# Altium project ee453_pcb_N-B-S.PrjPcb
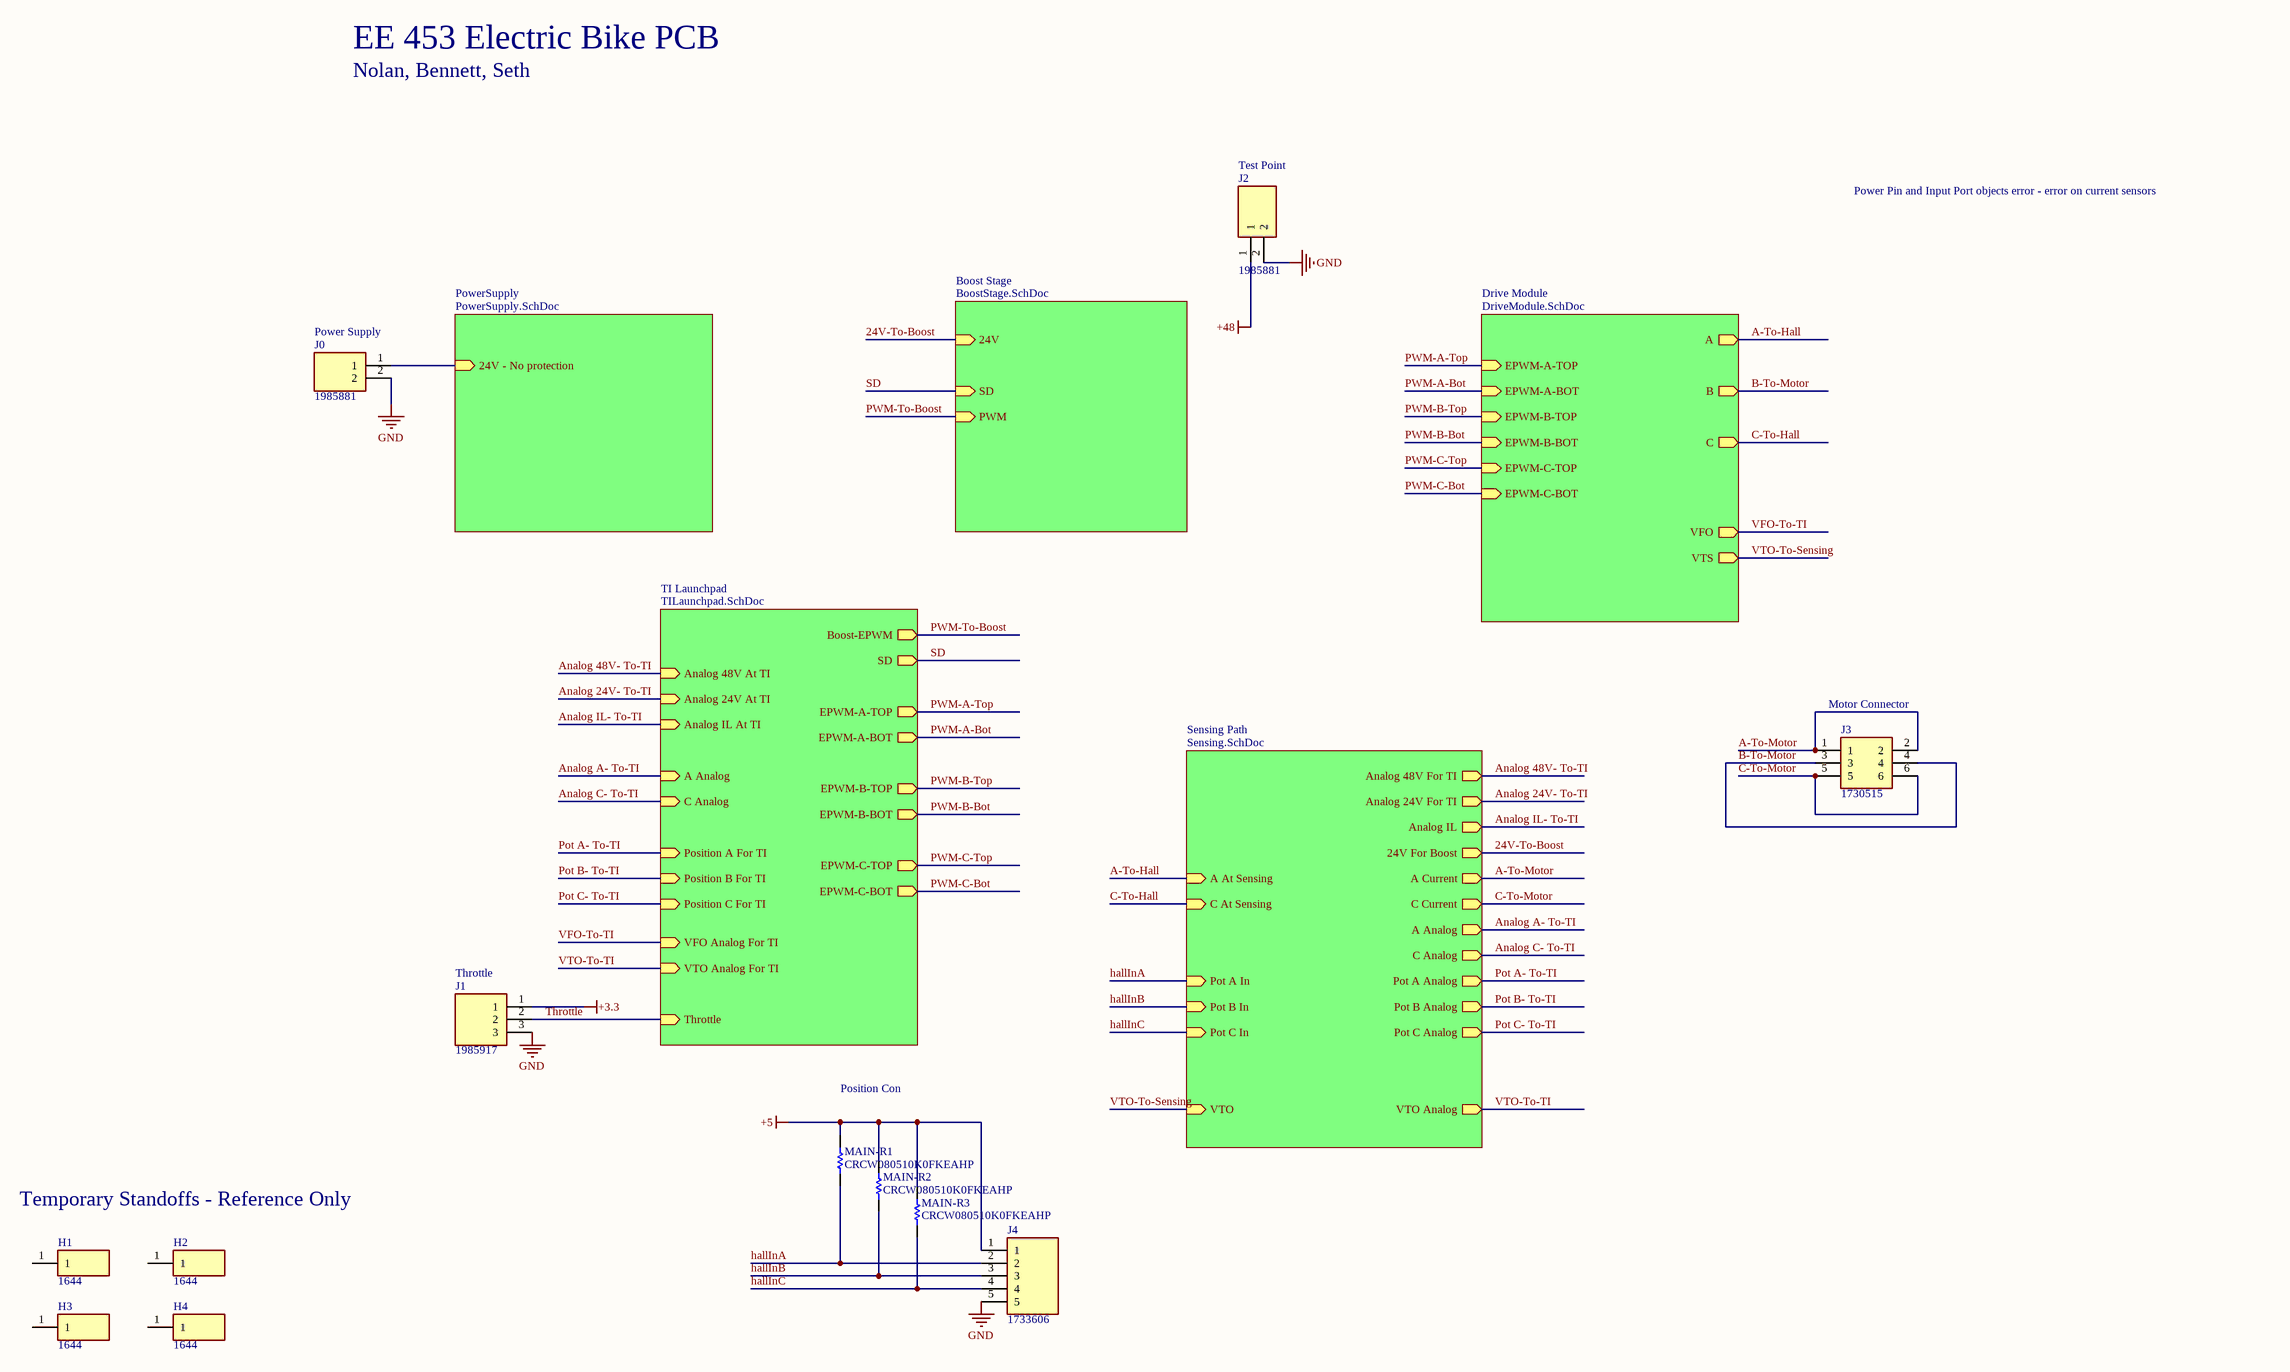
[diagram p0: ee453_pcb_N-B-S.SchDoc]
9 sheets, 101 parts. Net scope: hierarchical (ports join the sheet entries above them; power ports are global).
Board file: ee453_pcb_N-B-S.PcbDoc
Sheets:
  ee453_pcb_N-B-S.SchDoc
    PowerSupply = PowerSupply.SchDoc
    TI Launchpad = TILaunchpad.SchDoc
    Drive Module = DriveModule.SchDoc
    Boost Stage = BoostStage.SchDoc
    Sensing Path = Sensing.SchDoc
      Designator = VoltageSensing.SchDoc
      Designator = hallsensing.SchDoc
      Designator = positionsensing.SchDoc

## Sheet ee453_pcb_N-B-S.SchDoc: EE 453 Capstone
size C; ApprovedBy: Your Name; CheckedBy: Your Name; Author: Your Name; CompanyName: Dept. of Elec. and Comp. Engg.; DrawnBy: Your Name; Engineer: Your Nmae; Organization: UW-Seattle; Address1: 185 Stevens Way; Address2: Paul Allen Center; Address3: Seattle, WA; Address4: US-98195; DocumentNumber: 1; Revision: 1.0; SheetNumber: 1; SheetTotal: 1

### Parts
H1  1644  [1644]
H2  1644  [1644]
H3  1644  [1644]
H4  1644  [1644]
J0  1985881  [1985881]
J1  1985917  [1985917]
J2  1985881  [1985881]
J3  1730515  [1730515]
J4  1733606  [1733606]
MAIN-R1  CRCW080510K0FKEAHP  [RESC2013X60X40NL15T20]
MAIN-R2  CRCW080510K0FKEAHP  [RESC2013X60X40NL15T20]
MAIN-R3  CRCW080510K0FKEAHP  [RESC2013X60X40NL15T20]

### Sub-sheets
Boost Stage = BoostStage.SchDoc: 24V (in), SD (in), PWM (in)
Drive Module = DriveModule.SchDoc: EPWM-A-TOP (in), EPWM-A-BOT (in), EPWM-B-TOP (in), EPWM-B-BOT (in), EPWM-C-TOP (in), EPWM-C-BOT (in), A (out), B (out), C (out), VFO (out), VTS (out)
PowerSupply = PowerSupply.SchDoc: 24V - No protection (in)
Sensing Path = Sensing.SchDoc: A At Sensing (in), C At Sensing (in), Analog 24V For TI (out), Analog IL (out), A Current (out), C Current (out), Analog 48V For TI (out), Pot A Analog (out), Pot B Analog (out), Pot C Analog (out), Pot A In (in), Pot B In (in), Pot C In (in), A Analog (out), C Analog (out), 24V For Boost (out), VTO Analog (out), VTO (in)
TI Launchpad = TILaunchpad.SchDoc: Analog 24V At TI (in), Analog IL At TI (in), A Analog (in), C Analog (in), Boost-EPWM (out), EPWM-A-TOP (out), EPWM-A-BOT (out), EPWM-B-TOP (out), EPWM-B-BOT (out), EPWM-C-TOP (out), EPWM-C-BOT (out), Position A For TI (in), Position B For TI (in), Position C For TI (in), SD (out), Analog 48V At TI (in), VFO Analog For TI (in), VTO Analog For TI (in), Throttle (in)

### Nets
+3.3: J1.1
+5: J4.1 MAIN-R1.2 MAIN-R2.2 MAIN-R3.2
+48: J2.1
GND: J0.2 J1.3 J2.2 J4.5
24V-To-Boost: sheet Boost Stage/24V, sheet Sensing Path/24V For Boost
A-To-Hall: sheet Drive Module/A, sheet Sensing Path/A At Sensing
A-To-Motor: J3.1 J3.2 ; sheet Sensing Path/A Current
Analog 24V- To-TI: sheet TI Launchpad/Analog 24V At TI, sheet Sensing Path/Analog 24V For TI
Analog 48V- To-TI: sheet TI Launchpad/Analog 48V At TI, sheet Sensing Path/Analog 48V For TI
Analog A- To-TI: sheet TI Launchpad/A Analog, sheet Sensing Path/A Analog
Analog C- To-TI: sheet TI Launchpad/C Analog, sheet Sensing Path/C Analog
Analog IL- To-TI: sheet TI Launchpad/Analog IL At TI, sheet Sensing Path/Analog IL
B-To-Motor: J3.3 J3.4 ; sheet Drive Module/B
C-To-Hall: sheet Drive Module/C, sheet Sensing Path/C At Sensing
C-To-Motor: J3.5 J3.6 ; sheet Sensing Path/C Current
hallInA: J4.2 MAIN-R1.1 ; sheet Sensing Path/Pot A In
hallInB: J4.3 MAIN-R2.1 ; sheet Sensing Path/Pot B In
hallInC: J4.4 MAIN-R3.1 ; sheet Sensing Path/Pot C In
Pot A- To-TI: sheet TI Launchpad/Position A For TI, sheet Sensing Path/Pot A Analog
Pot B- To-TI: sheet TI Launchpad/Position B For TI, sheet Sensing Path/Pot B Analog
Pot C- To-TI: sheet TI Launchpad/Position C For TI, sheet Sensing Path/Pot C Analog
PWM-A-Bot: sheet TI Launchpad/EPWM-A-BOT, sheet Drive Module/EPWM-A-BOT
PWM-A-Top: sheet TI Launchpad/EPWM-A-TOP, sheet Drive Module/EPWM-A-TOP
PWM-B-Bot: sheet TI Launchpad/EPWM-B-BOT, sheet Drive Module/EPWM-B-BOT
PWM-B-Top: sheet TI Launchpad/EPWM-B-TOP, sheet Drive Module/EPWM-B-TOP
PWM-C-Bot: sheet TI Launchpad/EPWM-C-BOT, sheet Drive Module/EPWM-C-BOT
PWM-C-Top: sheet TI Launchpad/EPWM-C-TOP, sheet Drive Module/EPWM-C-TOP
PWM-To-Boost: sheet TI Launchpad/Boost-EPWM, sheet Boost Stage/PWM
SD: sheet TI Launchpad/SD, sheet Boost Stage/SD
Throttle: J1.2 ; sheet TI Launchpad/Throttle
VFO-To-TI: sheet TI Launchpad/VFO Analog For TI, sheet Drive Module/VFO
VTO-To-Sensing: sheet Drive Module/VTS, sheet Sensing Path/VTO
VTO-To-TI: sheet TI Launchpad/VTO Analog For TI, sheet Sensing Path/VTO Analog
NetJ0_1: J0.1 ; sheet PowerSupply/24V - No protection

Not connected (* = marked no-connect by the designer): H1 1; H2 1; H3 1; H4 1

### Notes on the sheet
- EE 453 Electric Bike PCB
- Nolan, Bennett, Seth
- Test Point
- Power Pin and Input Port objects error - error on current sensors
- (near J0) Power Supply
- (near J3) Motor Connector
- (near J1) Throttle
- Position Con
- Temporary Standoffs - Reference Only
- Title
- Size:
- Date:
- File:
- C
- Number:
- Time:
- Revision:
- Sheet
- of

### Library data of the parts
H1-H4 = 1644: Hardware; Manufacturer_Name: Keystone Electronics; Datasheet Link: https://www.mouser.com/datasheet/2/215/644-745864.pdf; Height: 25.4mm; Manufacturer_Part_Number: 1644; Mouser Part Number: 534-1644; Mouser Price/Stock: https://www.mouser.com/Search/Refine.aspx?Keyword=534-1644
J0 J2 = 1985881: Connector; Manufacturer_Name: Phoenix Contact; Datasheet Link: https://www.digikey.com/en/products/detail/phoenix-contact/1985881/2511015; Height: 13.9mm; Manufacturer_Part_Number: 1985881
J1 = 1985917: Connector; Manufacturer_Name: Phoenix Contact; Datasheet Link: https://media.digikey.com/pdf/Data%20Sheets/Phoenix%20Contact%20PDFs/Multi-Postion%20PCTerminal%20Blocks.pdf; Height: 13.95mm; Manufacturer_Part_Number: 1985917; Mouser Part Number: 651-1985917; Mouser Price/Stock: https://www.mouser.co.uk/ProductDetail/Phoenix-Contact/1985917/?qs=ibOxrZ%2Fd8eDdpJplVMXgvQ%3D%3D; Arrow Part Number: 1985917; Arrow Price/Stock: https://www.arrow.com/en/products/1985917/phoenix-contact
J3 = 1730515: Connector; Manufacturer_Name: Phoenix Contact; Datasheet Link: https://media.digikey.com/PDF/Data%20Sheets/Phoenix%20Contact%20PDFs/1730515.pdf; Height: 18mm; Manufacturer_Part_Number: 1730515; Mouser Part Number: 651-1730515; Mouser Price/Stock: https://www.mouser.com/Search/Refine.aspx?Keyword=651-1730515; Arrow Part Number: 1730515; Arrow Price/Stock: https://www.arrow.com/en/products/1730515/phoenix-contact
J4 = 1733606: Connector; Manufacturer_Name: Phoenix Contact; Datasheet Link: https://www.phoenixcontact.com/online/portal/us?uri=pxc-oc-itemdetail:pid=1733606&library=usen&tab=1; Height: 15.45mm; Manufacturer_Part_Number: 1733606; Mouser Part Number: 651-1733606; Mouser Price/Stock: https://www.mouser.co.uk/ProductDetail/Phoenix-Contact/1733606/?qs=coeDwHeOZKnxpzvXWWKBZQ%3D%3D; Arrow Part Number: 1733606; Arrow Price/Stock: https://www.arrow.com/en/products/1733606/phoenix-contact
MAIN-R1-MAIN-R3 = CMP-2001-04472-1: Manufacturer: Vishay Dale; Part Number: CRCW080510K0FKEAHP

## Sheet PowerSupply.SchDoc
size A
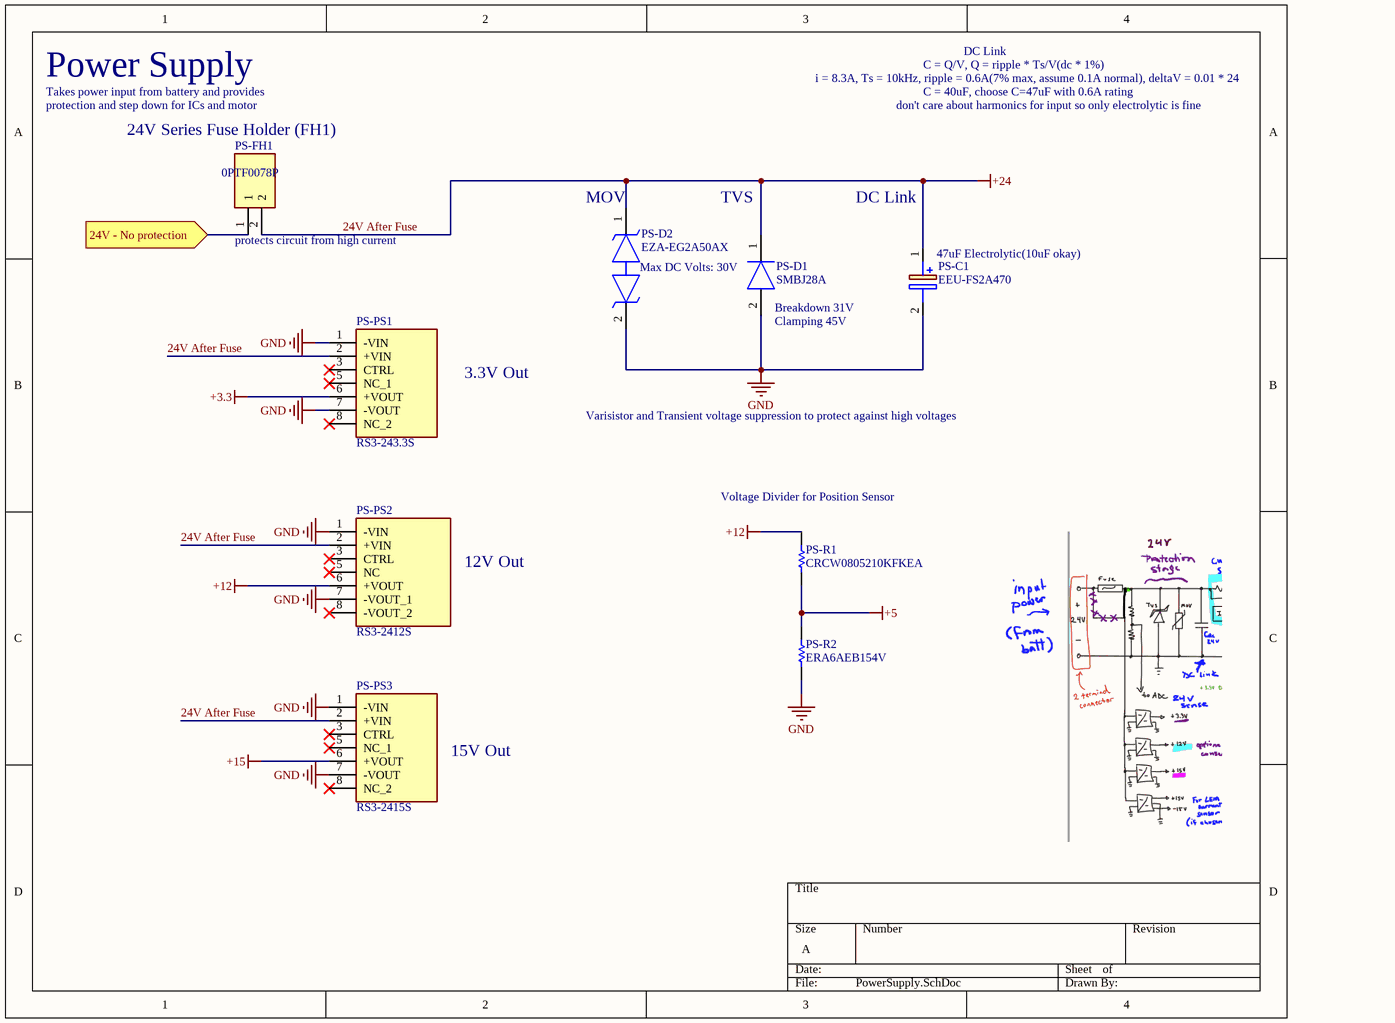
[diagram p1: PowerSupply.SchDoc]

### Parts
PS-C1  EEU-FS2A470  [CAPPRD350W65D800H1650]
PS-D1  SMBJ28A  [DIOM5436X261N]
PS-D2  EZA-EG2A50AX  [DIONC1005X43N]
PS-FH1  0PTF0078P  [0PTF0078P]
PS-PS1  RS3-243.3S  [RS32433S]
PS-PS2  RS3-2412S  [RS32415S]
PS-PS3  RS3-2415S  [RS32415S]
PS-R1  CRCW0805210KFKEA  [RESC2013X50X30LL20T20]
PS-R2  ERA6AEB154V  [RESC2013X60X40LL20T25]

### Ports
24V - No protection (in)

### Nets
24V After Fuse: PS-C1.1(+) PS-D1.1(K) PS-D2.1 PS-FH1.2 PS-PS1.2(+VIN) PS-PS2.2(+VIN) PS-PS3.2(+VIN)  [also labelled +24]
+3.3: PS-PS1.6(+VOUT)
+5: PS-R1.1 PS-R2.2
+12: PS-PS2.6(+VOUT) PS-R1.2
+15: PS-PS3.6(+VOUT)
GND: PS-C1.2(-) PS-D1.2(A) PS-D2.2 PS-PS1.1(-VIN) PS-PS1.7(-VOUT) PS-PS2.1(-VIN) PS-PS2.7(-VOUT_1) PS-PS3.1(-VIN) PS-PS3.7(-VOUT) PS-R2.1
NetJ0_1: PS-FH1.1 ; port 24V - No protection

Not connected (* = marked no-connect by the designer): PS-PS1 3(CTRL)* 5(NC_1)* 8(NC_2)*; PS-PS2 3(CTRL)* 5(NC)* 8(-VOUT_2)*; PS-PS3 3(CTRL)* 5(NC_1)* 8(NC_2)*

### Notes on the sheet
- Power Supply
- Takes power input from battery and provides
- i = 8.3A, Ts = 10kHz, ripple = 0.6A(7% max, assume 0.1A normal), deltaV = 0.01 * 24
- C = Q/V, Q = ripple * Ts/V(dc * 1%)
- C = 40uF, choose C=47uF with 0.6A rating
- DC Link
- protection and step down for ICs and motor
- 24V Series Fuse Holder (FH1)
- don't care about harmonics for input so only electrolytic is fine
- (near PS-D2) MOV
- TVS
- (near PS-FH1) protects circuit from high current
- Max DC Volts: 30V
- (near PS-C1) 47uF Electrolytic(10uF okay)
- (near PS-D1) Breakdown 31V
- (near PS-D1) Clamping 45V
- 3.3V Out
- Varisistor and Transient voltage suppression to protect against high voltages
- (near PS-R1) Voltage Divider for Position Sensor
- 12V Out
- 15V Out

### Library data of the parts
PS-C1 = EEU-FS2A470: Capacitor Polarised 47uF; Manufacturer_Name: Panasonic; Datasheet Link: https://componentsearchengine.com/Datasheets/1/EEU-FS2A470.pdf; Height: 16.5mm; Manufacturer_Part_Number: EEU-FS2A470; Mouser Part Number: 667-EEU-FS2A470; Mouser Price/Stock: https://www.mouser.co.uk/ProductDetail/Panasonic/EEU-FS2A470?qs=w%2Fv1CP2dgqrDlaRaE647gA%3D%3D; Arrow Part Number: EEU-FS2A470; Arrow Price/Stock: https://www.arrow.com/en/products/eeu-fs2a470/panasonic
PS-D1 = SMBJ28A: Diode; Manufacturer_Name: LITTELFUSE; Datasheet Link: https://componentsearchengine.com/Datasheets/2/SMBJ28A.pdf; Height: 2.61mm; Manufacturer_Part_Number: SMBJ28A; Mouser Part Number: 576-SMBJ28A; Mouser Price/Stock: https://www.mouser.co.uk/ProductDetail/Littelfuse/SMBJ28A?qs=JJML70Qc14vmSTVTa1LvqQ%3D%3D; Arrow Part Number: SMBJ28A; Arrow Price/Stock: https://www.arrow.com/en/products/smbj28a/littelfuse
PS-D2 = EZA-EG2A50AX: TVS Diode (Bi-directional); Manufacturer_Name: Panasonic; Datasheet Link: https://industrial.panasonic.com/cdbs/www-data/pdf/AWD0000/AWD0000C23.pdf; Height: 0.43mm; Manufacturer_Part_Number: EZA-EG2A50AX; Mouser Part Number: 667-EZA-EG2A50AX; Mouser Price/Stock: https://www.mouser.co.uk/ProductDetail/Panasonic/EZA-EG2A50AX?qs=WwqriLBepZuVGjkTEFYPQg%3D%3D; Arrow Part Number: EZA-EG2A50AX; Arrow Price/Stock: https://www.arrow.com/en/products/eza-eg2a50ax/panasonic
PS-FH1 = 0PTF0078P: Undefined or Miscellaneous; Manufacturer_Name: LITTELFUSE; Datasheet Link: https://media.digikey.com/pdf/Data%20Sheets/Littelfuse%20PDFs/PTF075_77_78.pdf; Height: 11.5mm; Manufacturer_Part_Number: 0PTF0078P; Mouser Part Number: 576-0PTF0078P; Mouser Price/Stock: https://www.mouser.co.uk/ProductDetail/Littelfuse/0PTF0078P?qs=Co4VkB5J4%2Fsczy6gG8s%2FsA%3D%3D; Arrow Part Number: 0PTF0078P; Arrow Price/Stock: https://www.arrow.com/en/products/0ptf0078p/littelfuse
PS-PS1 = RS3-243.3S: Power Supply; Manufacturer_Name: RECOM Power; Datasheet Link: https://www.arrow.com/en/products/rs3-243.3s/recom-power; Height: 11.35mm; Manufacturer_Part_Number: RS3-243.3S; Mouser Part Number: 919-RS3-243.3S; Mouser Price/Stock: https://www.mouser.com/Search/Refine.aspx?Keyword=919-RS3-243.3S; Arrow Part Number: RS3-243.3S; Arrow Price/Stock: https://www.arrow.com/en/products/rs3-243.3s/recom-power
PS-PS2 = RS3-2412S: Power Supply 12V; Manufacturer_Name: RECOM Power; Datasheet Link: https://www.recom-power.com/pdf/Econoline/RS3-S_D_Z.pdf; Manufacturer_Part_Number: RS3-2412S; Mouser Part Number: 919-RS3-2412S; Mouser Price/Stock: https://www.mouser.com/Search/Refine.aspx?Keyword=919-RS3-2412S; RS Part Number: 1669097; RS Price/Stock: https://uk.rs-online.com/web/p/products/1669097
PS-PS3 = RS3-2415S: Power Supply; Manufacturer_Name: RECOM Power; Datasheet Link: https://www.recom-power.com/pdf/Econoline/RS3-S_D_Z.pdf; Height: 11.35mm; Manufacturer_Part_Number: RS3-2415S; Mouser Part Number: 919-RS3-2415S; Mouser Price/Stock: https://www.mouser.com/Search/Refine.aspx?Keyword=919-RS3-2415S
PS-R1 = CMP-1013-00770-2: Manufacturer: Vishay Dale; Part Number: CRCW0805210KFKEA
PS-R2 = CMP-2001-00599-1: Manufacturer: Panasonic; Part Number: ERA6AEB154V

## Sheet TILaunchpad.SchDoc
size A
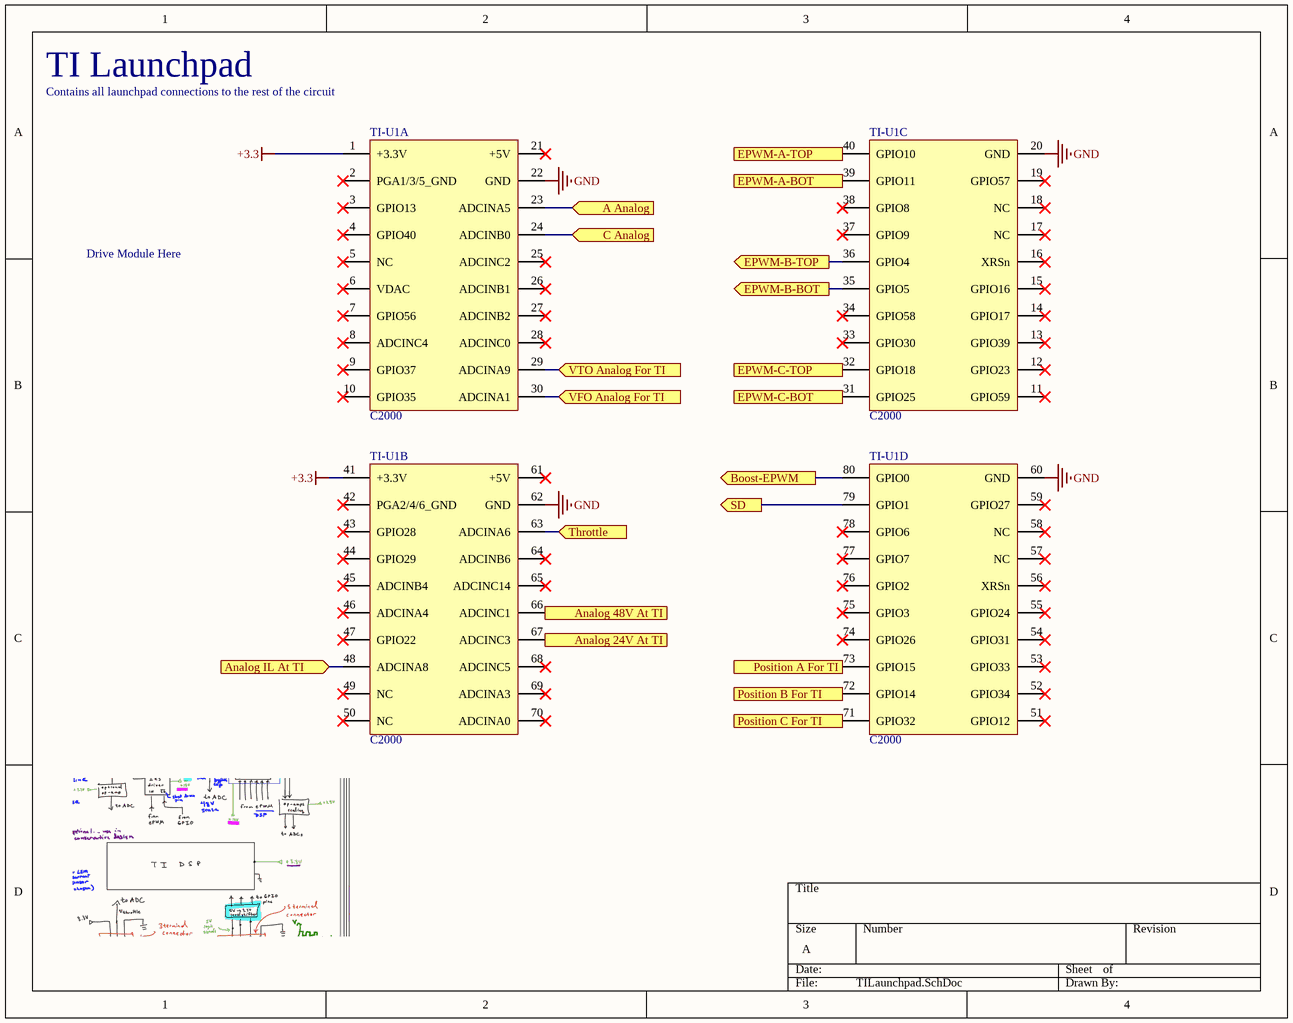
[diagram p2: TILaunchpad.SchDoc]

### Parts
TI-U1  C2000  [C2000]  (parts A,B,C,D of 4)

### Ports
A Analog (in), Analog 24V At TI (in), Analog 48V At TI (in), Analog IL At TI (in), Boost-EPWM (out), C Analog (in), EPWM-A-BOT (out), EPWM-A-TOP (out), EPWM-B-BOT (out), EPWM-B-TOP (out), EPWM-C-BOT (out), EPWM-C-TOP (out), Position A For TI (in), Position B For TI (in), Position C For TI (in), SD (out), Throttle (in), VFO Analog For TI (in), VTO Analog For TI (in)

### Nets
+3.3: TI-U1.1(+3.3V) TI-U1.41(+3.3V)
GND: TI-U1.20(GND) TI-U1.22(GND) TI-U1.60(GND) TI-U1.62(GND)
Analog 24V- To-TI: TI-U1.67(ADCINC3) ; port Analog 24V At TI
Analog 48V- To-TI: TI-U1.66(ADCINC1) ; port Analog 48V At TI
Analog A- To-TI: TI-U1.23(ADCINA5) ; port A Analog
Analog C- To-TI: TI-U1.24(ADCINB0) ; port C Analog
Analog IL- To-TI: TI-U1.48(ADCINA8) ; port Analog IL At TI
Pot A- To-TI: TI-U1.73(GPIO15) ; port Position A For TI
Pot B- To-TI: TI-U1.72(GPIO14) ; port Position B For TI
Pot C- To-TI: TI-U1.71(GPIO32) ; port Position C For TI
PWM-A-Bot: TI-U1.39(GPIO11) ; port EPWM-A-BOT
PWM-A-Top: TI-U1.40(GPIO10) ; port EPWM-A-TOP
PWM-B-Bot: TI-U1.35(GPIO5) ; port EPWM-B-BOT
PWM-B-Top: TI-U1.36(GPIO4) ; port EPWM-B-TOP
PWM-C-Bot: TI-U1.31(GPIO25) ; port EPWM-C-BOT
PWM-C-Top: TI-U1.32(GPIO18) ; port EPWM-C-TOP
PWM-To-Boost: TI-U1.80(GPIO0) ; port Boost-EPWM
SD: TI-U1.79(GPIO1) ; port SD
Throttle: TI-U1.63(ADCINA6) ; port Throttle
VFO-To-TI: TI-U1.30(ADCINA1) ; port VFO Analog For TI
VTO-To-TI: TI-U1.29(ADCINA9) ; port VTO Analog For TI

Not connected (* = marked no-connect by the designer): TI-U1 2(PGA1/3/5_GND)* 3(GPIO13)* 4(GPIO40)* 5(NC)* 6(VDAC)* 7(GPIO56)* 8(ADCINC4)* 9(GPIO37)* 10(GPIO35)* 11(GPIO59)* 12(GPIO23)* 13(GPIO39)* 14(GPIO17)* 15(GPIO16)* 16(XRSn)* 17(NC)* 18(NC)* 19(GPIO57)* 21(+5V)* 25(ADCINC2)* 26(ADCINB1)* 27(ADCINB2)* 28(ADCINC0)* 33(GPIO30)* 34(GPIO58)* 37(GPIO9)* 38(GPIO8)* 42(PGA2/4/6_GND)* 43(GPIO28)* 44(GPIO29)* 45(ADCINB4)* 46(ADCINA4)* 47(GPIO22)* 49(NC)* 50(NC)* 51(GPIO12)* 52(GPIO34)* 53(GPIO33)* 54(GPIO31)* 55(GPIO24)* 56(XRSn)* 57(NC)* 58(NC)* 59(GPIO27)* 61(+5V)* 64(ADCINB6)* 65(ADCINC14)* 68(ADCINC5)* 69(ADCINA3)* 70(ADCINA0)* 74(GPIO26)* 75(GPIO3)* 76(GPIO2)* 77(GPIO7)* 78(GPIO6)*

### Notes on the sheet
- TI Launchpad
- Contains all launchpad connections to the rest of the circuit
- Drive Module Here

### Library data of the parts
TI-U1 = C2000: F280049C; Parameter 1: test 2

## Sheet DriveModule.SchDoc
size A
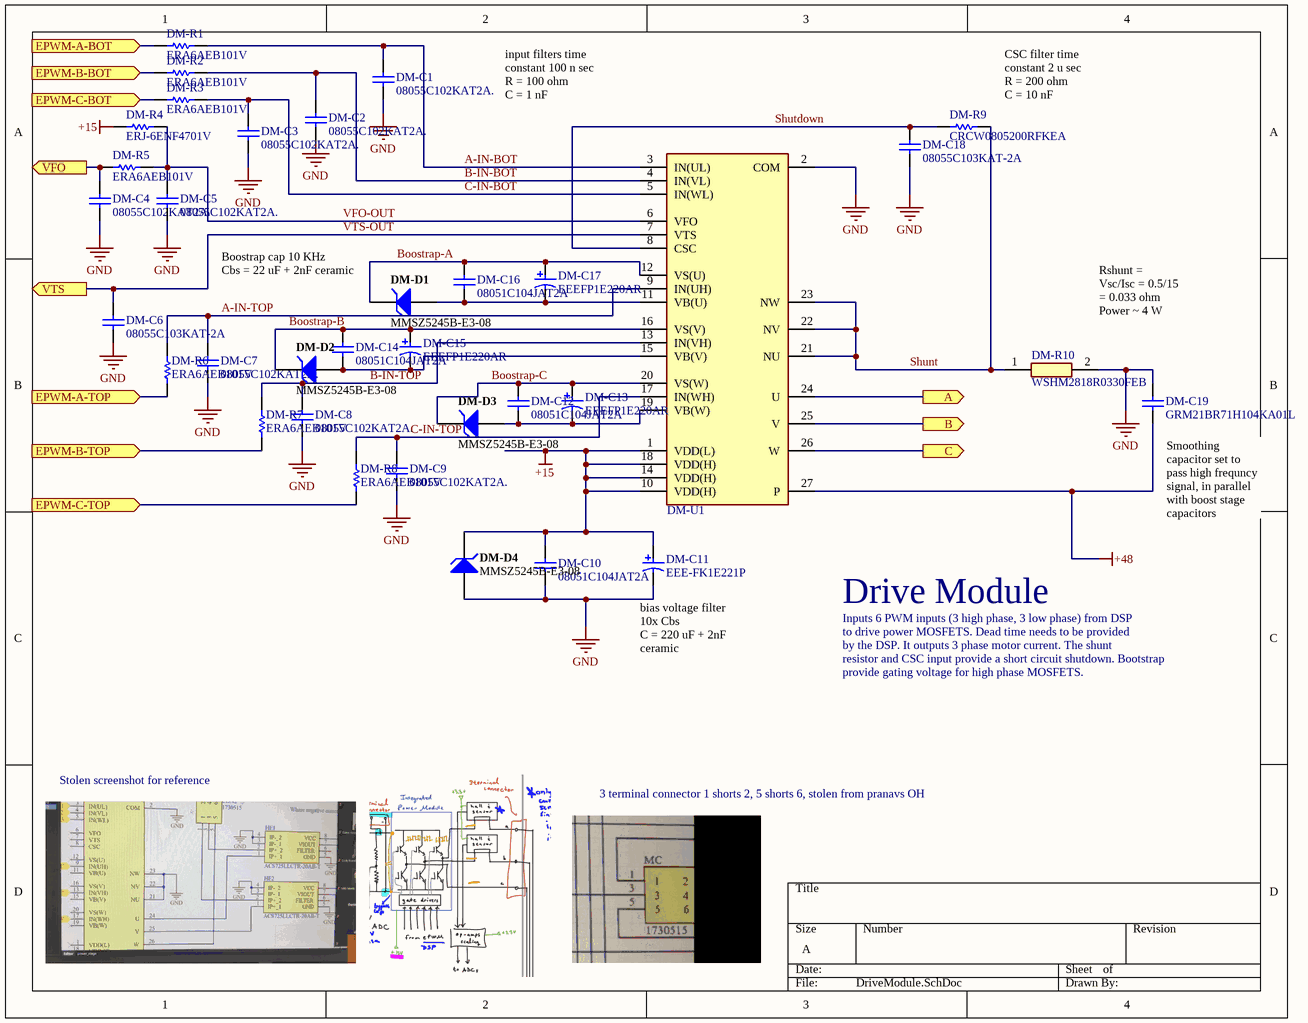
[diagram p3: DriveModule.SchDoc]

### Parts
DM-C1  08055C102KAT2A.  [CAPC2013X94X50ML20T25]
DM-C2  08055C102KAT2A.  [CAPC2013X94X50ML20T25]
DM-C3  08055C102KAT2A.  [CAPC2013X94X50ML20T25]
DM-C4  08055C102KAT2A.  [CAPC2013X94X50ML20T25]
DM-C5  08055C102KAT2A.  [CAPC2013X94X50ML20T25]
DM-C6  08055C103KAT-2A  [CAPC2013X94X50NL20T25]
DM-C7  08055C102KAT2A.  [CAPC2013X94X50ML20T25]
DM-C8  08055C102KAT2A.  [CAPC2013X94X50ML20T25]
DM-C9  08055C102KAT2A.  [CAPC2013X94X50ML20T25]
DM-C10  08051C104JAT2A  [CAPC2013X94X50ML20T25]
DM-C11  EEE-FK1E221P  [PNSC-EEE-FK1E221P_N]
DM-C12  08051C104JAT2A  [CAPC2013X94X50ML20T25]
DM-C13  EEEFP1E220AR  [PNSC-FP-V-C_V]
DM-C14  08051C104JAT2A  [CAPC2013X94X50ML20T25]
DM-C15  EEEFP1E220AR  [PNSC-FP-V-C_V]
DM-C16  08051C104JAT2A  [CAPC2013X94X50ML20T25]
DM-C17  EEEFP1E220AR  [PNSC-FP-V-C_V]
DM-C18  08055C103KAT-2A  [CAPC2013X94X50NL20T25]
DM-C19  GRM21BR71H104KA01L  [CAPC2013X135X45ML10T25]
DM-D1  MMSZ5245B-E3-08  [VISH-SOD-123-2_V]
DM-D2  MMSZ5245B-E3-08  [VISH-SOD-123-2_V]
DM-D3  MMSZ5245B-E3-08  [VISH-SOD-123-2_V]
DM-D4  MMSZ5245B-E3-08  [VISH-SOD-123-2_V]
DM-R1  ERA6AEB101V  [RESC2013X60X40ML20T25]
DM-R2  ERA6AEB101V  [RESC2013X60X40ML20T25]
DM-R3  ERA6AEB101V  [RESC2013X60X40ML20T25]
DM-R4  ERJ-6ENF4701V  [RESC2013X70X40NL20T20]
DM-R5  ERA6AEB101V  [RESC2013X60X40ML20T25]
DM-R6  ERA6AEB101V  [RESC2013X60X40ML20T25]
DM-R7  ERA6AEB101V  [RESC2013X60X40ML20T25]
DM-R8  ERA6AEB101V  [RESC2013X60X40ML20T25]
DM-R9  CRCW0805200RFKEA  [RESC2013X50X30NL20T20]
DM-R10  WSHM2818R0330FEB  [WSHM2818R0330FEB]
DM-U1  FNB34060T  [FNB34060T]  (value not drawn)

### Ports
A (out), B (out), C (out), EPWM-A-BOT (in), EPWM-A-TOP (in), EPWM-B-BOT (in), EPWM-B-TOP (in), EPWM-C-BOT (in), EPWM-C-TOP (in), VFO (out), VTS (out)

### Nets
+15: DM-C10.2 DM-C11.1 DM-D4.2(K) DM-R4.1 DM-U1.1(VDD(L)) DM-U1.10(VDD(H)) DM-U1.14(VDD(H)) DM-U1.18(VDD(H))
+48: DM-C19.1 DM-U1.27(P)
GND: DM-C1.1 DM-C2.1 DM-C3.1 DM-C4.1 DM-C5.1 DM-C6.1 DM-C7.1 DM-C8.1 DM-C9.1 DM-C10.1 DM-C11.2 DM-C18.1 DM-C19.2 DM-D4.1(A) DM-R10.2 DM-U1.2(COM)
A-IN-BOT: DM-C1.2 DM-R1.2 DM-U1.3(IN(UL))
A-IN-TOP: DM-C7.2 DM-R6.2 DM-U1.9(IN(UH))
A-To-Hall: DM-U1.24(U) ; port A
B-IN-BOT: DM-C2.2 DM-R2.2 DM-U1.4(IN(VL))
B-IN-TOP: DM-C8.2 DM-R7.2 DM-U1.13(IN(VH))
B-To-Motor: DM-U1.25(V) ; port B
Boostrap-A: DM-C16.2 DM-C17.1 DM-D1.2(K) DM-U1.12(VS(U))
Boostrap-B: DM-C14.2 DM-C15.1 DM-D2.2(K) DM-U1.16(VS(V))
Boostrap-C: DM-C12.2 DM-C13.1 DM-D3.2(K) DM-U1.20(VS(W))
C-IN-BOT: DM-C3.2 DM-R3.2 DM-U1.5(IN(WL))
C-IN-TOP: DM-C9.2 DM-R8.2 DM-U1.17(IN(WH))
C-To-Hall: DM-U1.26(W) ; port C
PWM-A-Bot: DM-R1.1 ; port EPWM-A-BOT
PWM-A-Top: DM-R6.1 ; port EPWM-A-TOP
PWM-B-Bot: DM-R2.1 ; port EPWM-B-BOT
PWM-B-Top: DM-R7.1 ; port EPWM-B-TOP
PWM-C-Bot: DM-R3.1 ; port EPWM-C-BOT
PWM-C-Top: DM-R8.1 ; port EPWM-C-TOP
Shunt: DM-R9.1 DM-R10.1 DM-U1.21(NU) DM-U1.22(NV) DM-U1.23(NW)
Shutdown: DM-C18.2 DM-R9.2 DM-U1.8(CSC)
VFO-OUT: DM-C5.2 DM-R4.2 DM-R5.2 DM-U1.6(VFO)
VFO-To-TI: DM-C4.2 DM-R5.1 ; port VFO
VTS-OUT: DM-C6.2 DM-U1.7(VTS) ; port VTS  [project net VTO-To-Sensing]
NetDM-C12_1: DM-C12.1 DM-C13.2 DM-D3.1(A) DM-U1.19(VB(W))
NetDM-C14_1: DM-C14.1 DM-C15.2 DM-D2.1(A) DM-U1.15(VB(V))
NetDM-C16_1: DM-C16.1 DM-C17.2 DM-D1.1(A) DM-U1.11(VB(U))

### Notes on the sheet
- input filters time constant 100 n sec
  R = 100 ohm
  C = 1 nF
- (near DM-R9) CSC filter time constant 2 u sec
  R = 200 ohm
  C = 10 nF
- Boostrap cap 10 KHz
  Cbs = 22 uF + 2nF ceramic
- Rshunt = Vsc/Isc = 0.5/15 = 0.033 ohm
  Power ~ 4 W
- (near DM-C19) Smoothing capacitor set to pass high frequncy signal, in parallel with boost stage capacitors
- Drive Module
- Inputs 6 PWM inputs (3 high phase, 3 low phase) from DSP
- to drive power MOSFETS. Dead time needs to be provided
- (near DM-C11) bias voltage filter 10x Cbs
  C = 220 uF + 2nF ceramic
- by the DSP. It outputs 3 phase motor current. The shunt
- resistor and CSC input provide a short circuit shutdown. Bootstrap
- provide gating voltage for high phase MOSFETS.
- Stolen screenshot for reference
- 3 terminal connector 1 shorts 2, 5 shorts 6, stolen from pranavs OH

### Library data of the parts
DM-C1-DM-C5 DM-C7-DM-C9 = CMP-1036-02979-2: 1 nF cap; Manufacturer: AVX Interconnect / Elco; Part Number: 08055C102KAT2A.
DM-C6 DM-C18 = CMP-2007-04363-1: 10 nF cap; Manufacturer: AVX Interconnect / Elco; Part Number: 08055C103KAT-2A
DM-C10 DM-C12 DM-C14 DM-C16 = CMP-1036-04427-2: Manufacturer: AVX Interconnect / Elco; Part Number: 08051C104JAT2A
DM-C11 = CMP-1665-00017-3: Aluminum Electrolytic Capacitor, 220 uF, +/- 20%, 25 V, -55 to 105 degC, 2-Pin CAPAE, RoHS, Tape and Reel; Manufacturer: Panasonic; Voltage Rating: 25 V; ComponentLink2URL: http://industrial.panasonic.com/cdbs/www-data/pdf/RDE0000/ABA0000C1181.pdf; Height: 10.2 mm; Max Operating Temperature: 105 degC; PackageReference: EEE-FK1E221P; ComponentLink1Description: Manufacturer URL; ComponentLink1URL: http://www.panasonic.com/; Mount: Surface Mount; REACH SVHC: No SVHC; Min Operating Temperature: -55 degC; ComponentLink2Description: Datasheet; DatasheetVersion: 03/2016; Length: 10.2 mm; RoHSCompliant: true; Packaging: Tape and Reel; Package Quantity: 500; Lead Pitch: 3.1 mm; Pins: 2; PackageDescription: 2-Pin Electrolytic Aluminum Capacitor, Body 8.3 x 8.3 mm; Mounting Technology: Surface Mount
DM-C13 DM-C15 DM-C17 = CMP-2000-06213-1: Aluminum Electrolytic Capacitor, 22 uF, +/- 20%, 25 V, 2-Pin SMD (Size Code C), -55 to 105 degC, RoHS, Tape and Reel; Manufacturer: Panasonic; ESR (Equivalent Series Resistance): 0.36O; Ripple Current: 240mA; Capacitance: 22µF; Lifetime@Temperature: 2000Hrs@105°C; Rated Voltage: 25V; Package Reference: FP-V-C; Package Description: 2-Pin Electrolytic Aluminum Capacitor, Body 5.3 x 5.3 mm; Operating Temp Range: -55to+105°C; Mounting Technology: SurfaceMount; Datasheet URL: http://industrial.panasonic.com/cdbs/www-data/pdf/RDE0000/ABA0000C1184.pdf; Case Size/Dimension: Ø5x5.8mm; Operating Temp-Max: 105°C; Package URL: http://industrial.panasonic.com/cdbs/www-data/pdf/RDE0000/DME0000COL48.pdf; Datasheet Version: 03/2016; Series: FP; Manufacturer URL: http://www.panasonic.com/; Type: Can
DM-C19 = CMP-2100-03644-1: Chip Capacitor, 0.1 uF, +/- 10%, 50 V, -55 to 125 degC, 0805 (2012 Metric), RoHS, Tape and Reel; Manufacturer: Murata; Voltage: 50V; Capacitance: 100nF; Insulation Resistance: 10GR; Dielectric Material: Ceramic; Dielectric: X7R; Package Description: 2-Pin Surface Mount Device, Body 2 x 1.25 mm; Manufacturer URL: http://www.murata.com/; Case Code (Imperial): 0805; Datasheet URL: http://psearch.en.murata.com/capacitor/product/GRM21BR71H104KA01%23.pdf; Termination: SMD/SMT; Lead Free: LeadFree; Package Quantity: 1; Mount: SurfaceMount; REACH SVHC: Unknown; Thickness: 0.053inch; Height: 1.25mm; Case/Package: 0805; Voltage Rating: 50V; Width: 0.049inch; Case Code (Metric): 2012; Material: Ceramic; Min Operating Temperature: -55degC; RoHSCompliant: true; Datasheet Version: 42675.0; Voltage Rating (DC): 50V; Tolerance: 10%; Package Reference: 0805; Depth: 1.25mm; Length: 2mm; Max Operating Temperature: 125degC; Packaging: TapeandReel; Number of Pins: 2; Radiation Hardening: No
DM-D1-DM-D4 = CMP-0931-00033-1: Small Signal Zener Diode, 15 V +/- 5%, -55 to 155 degC, 2-Pin SOD-123, RoHS, Tape and Reel; Manufacturer: Vishay Semiconductor; Int. Construction: Single; Test Current (IZT1) (mA): 8.5; Zener Impedance (IZT1) (Max.) (Ohm): 16; Zener Voltage (NOM.) (V): 15; Power Dissipation (mW): 500; Tolerance: +/- 5%; PackageDescription: 2-Pin SMD, Body 2.7 x 1.55 mm, Height 1.35 mm; ComponentLink2Description: Datasheet; PackageVersion: Rev. 1.9; ComponentLink2URL: http://www.vishay.com/docs/85774/mmsz5225.pdf; RoHS: TRUE; Packing: Tape and Reel; Operating Temperature: -55 to 150 degC; ComponentLink1Description: Manufacturer URL; ComponentLink3Description: Package Specification; PackageReference: SOD-123-2; DatasheetVersion: Rev. 1.9; PartNumber: MMSZ5245B-E3-08; ComponentLink3URL: http://www.vishay.com/docs/85774/mmsz5225.pdf; Mounting Technology: Surface Mount; ComponentLink1URL: http://www.vishay.com/
DM-R1-DM-R3 DM-R6-DM-R8 = CMP-2001-00580-1: 100 ohm resistor; Manufacturer: Panasonic; Part Number: ERA6AEB101V
DM-R4 = CMP-2001-00550-5: Chip Resistor, 4.7 KOhm, +/- 1%, 0.125 W, -55 to 155 degC, 0805 (2012 Metric), RoHS, Tape and Reel; Manufacturer: Panasonic; Voltage Rating: 150 V; Min Operating Temperature: -55 degC; PackageReference: 0805; Mounting Technology: Surface Mount; Height: 0.6 mm; PackageDescription: 2-Pin Surface Mount Device, Body 2 x 1.25 mm; RoHSCompliant: true; Length: 2 mm; REACH SVHC: Yes; Packaging: Tape and Reel; Pins: 2; Mount: Surface Mount; ComponentLink2Description: Datasheet; ComponentLink1URL: http://www.panasonic.com/; ComponentLink1Description: Manufacturer URL; DatasheetVersion: 04/2015; Package Quantity: 5000; ComponentLink2URL: http://industrial.panasonic.com/cdbs/www-data/pdf/RDA0000/AOA0000C86.pdf; Max Operating Temperature: 155 degC
DM-R5 = CMP-2001-00580-1: Manufacturer: Panasonic; Part Number: ERA6AEB101V
DM-R9 = CMP-2001-03663-1: 200 ohm resistor; Manufacturer: Vishay Dale; Part Number: CRCW0805200RFKEA
DM-R10 = WSHM2818R0330FEB: Resistor; Manufacturer_Name: Vishay; Datasheet Link: https://componentsearchengine.com/Datasheets/2/WSHM2818R0330FEB.pdf; Height: 1.75mm; Manufacturer_Part_Number: WSHM2818R0330FEB; Mouser Part Number: 71-WSHM2818R0330FEB; Mouser Price/Stock: https://www.mouser.co.uk/ProductDetail/Vishay-Dale/WSHM2818R0330FEB?qs=Blj4iBE%2FJuORIC0JacTR6A%3D%3D
DM-U1 = FNB34060T: 3 phase power module

## Sheet BoostStage.SchDoc
size A
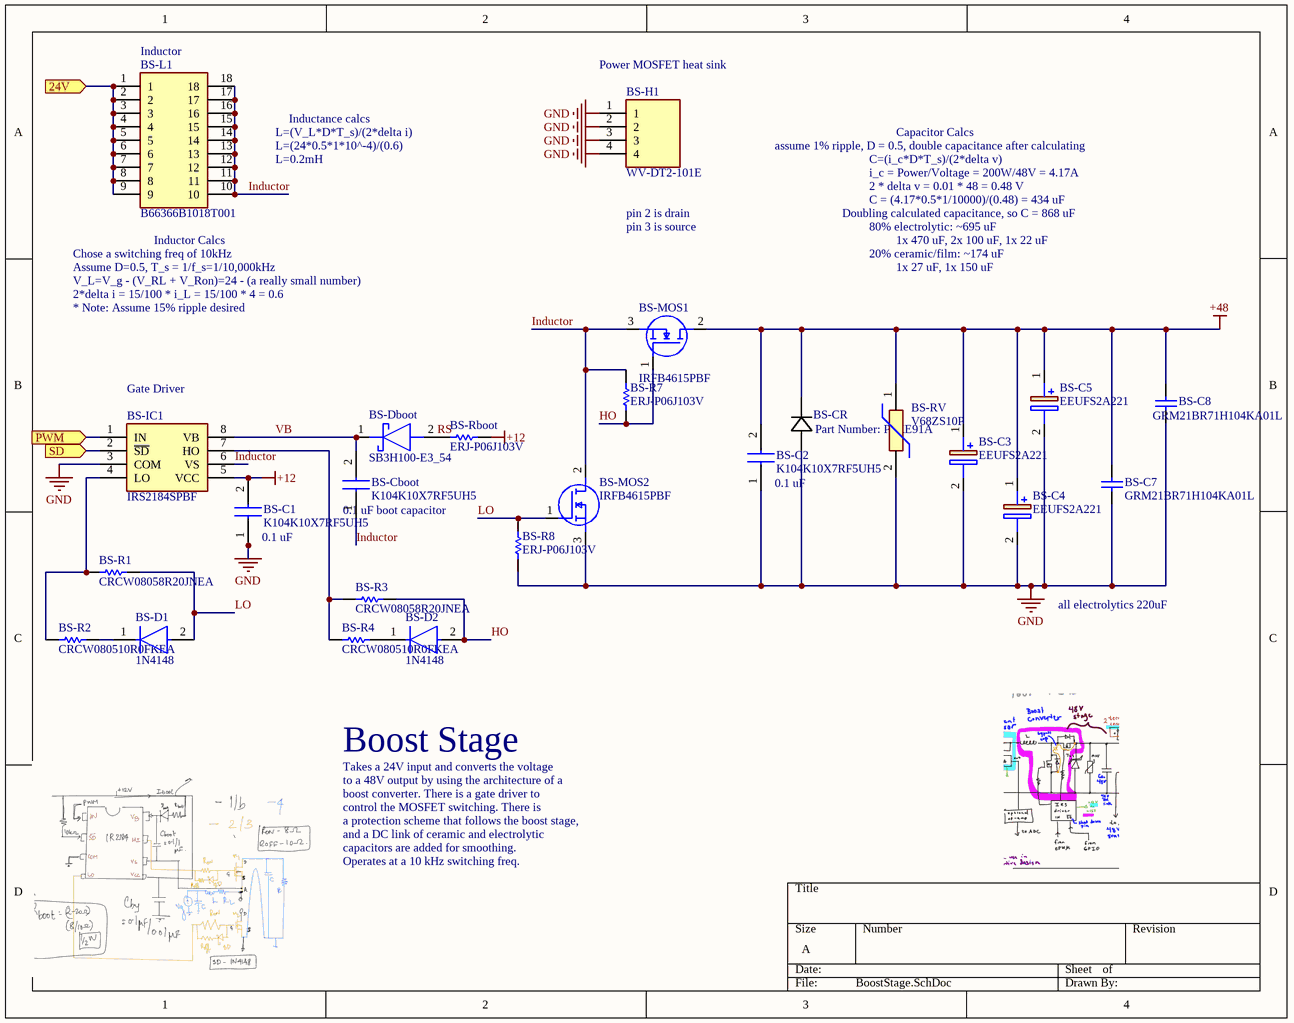
[diagram p4: BoostStage.SchDoc]

### Parts
BS-C1  K104K10X7RF5UH5  [K104K10X7RF5UH5]
BS-C2  K104K10X7RF5UH5  [K104K10X7RF5UH5]
BS-C3  EEUFS2A221  [CAPPRD500W65D1250H2700]
BS-C4  EEUFS2A221  [CAPPRD500W65D1250H2700]
BS-C5  EEUFS2A221  [CAPPRD500W65D1250H2700]
BS-C7  GRM21BR71H104KA01L  [CAPC2013X135X45ML10T25]
BS-C8  GRM21BR71H104KA01L  [CAPC2013X135X45ML10T25]
BS-Cboot  K104K10X7RF5UH5  [K104K10X7RF5UH5]
BS-CR  Part Number: P6KE91A  [P6KESeries]
BS-D1  1N4148  [FP-017AG-MFG]
BS-D2  1N4148  [FP-017AG-MFG]
BS-Dboot  SB3H100-E3_54  [DIOAD2855W132L835D505]
BS-H1  WV-DT2-101E  [WVDT2101E]
BS-IC1  IRS2184SPBF  [SOIC127P600X175-8N]
BS-L1  B66366B1018T001  [B66366B1018T001]
BS-MOS1  IRFB4615PBF  [TO254P483X1016X1994-3P]
BS-MOS2  IRFB4615PBF  [TO254P483X1016X1994-3P]
BS-R1  CRCW08058R20JNEA  [RESC2013X50X30NL20T20]
BS-R2  CRCW080510R0FKEA  [RESC2013X50X30NL20T20]
BS-R3  CRCW08058R20JNEA  [RESC2013X50X30NL20T20]
BS-R4  CRCW080510R0FKEA  [RESC2013X50X30NL20T20]
BS-R7  ERJ-P06J103V  [RESC2013X70X40ML20T20]
BS-R8  ERJ-P06J103V  [RESC2013X70X40ML20T20]
BS-Rboot  ERJ-P06J103V  [RESC2013X70X40ML20T20]
BS-RV  V68ZS10P  [V68ZS10P]

### Ports
24V (in), PWM (in), SD (in)

### Nets
+12: BS-C1.2 BS-IC1.5(VCC) BS-Rboot.2
+48: BS-C2.2 BS-C3.1(+) BS-C4.1(+) BS-C5.1(+) BS-C7.2 BS-C8.2 BS-CR.1 BS-MOS1.2(D) BS-RV.1
GND: BS-C1.1 BS-C2.1 BS-C3.2(-) BS-C4.2(-) BS-C5.2(-) BS-C7.1 BS-C8.1 BS-CR.2 BS-H1.1 BS-H1.2 BS-H1.3 BS-H1.4 BS-IC1.3(COM) BS-MOS2.3(S) BS-R8.1 BS-RV.2
24V-To-Boost: BS-L1.1 BS-L1.2 BS-L1.3 BS-L1.4 BS-L1.5 BS-L1.6 BS-L1.7 BS-L1.8 BS-L1.9 ; port 24V
HO: BS-D2.2(A) BS-MOS1.1(G) BS-R3.2 BS-R7.1
Inductor: BS-Cboot.1 BS-IC1.6(VS) BS-L1.10 BS-L1.11 BS-L1.12 BS-L1.13 BS-L1.14 BS-L1.15 BS-L1.16 BS-L1.17 BS-L1.18 BS-MOS1.3(S) BS-MOS2.2(D) BS-R7.2
LO: BS-D1.2(A) BS-MOS2.1(G) BS-R1.2 BS-R8.2
PWM-To-Boost: BS-IC1.1(IN) ; port PWM
RS: BS-Dboot.2(A) BS-Rboot.1
SD: BS-IC1.2(~{SD}) ; port SD
VB: BS-Cboot.2 BS-Dboot.1(K) BS-IC1.8(VB)
NetBS-D1_1: BS-D1.1(C) BS-R2.2
NetBS-D2_1: BS-D2.1(C) BS-R4.2
NetBS-IC1_4: BS-IC1.4(LO) BS-R1.1 BS-R2.1
NetBS-IC1_7: BS-IC1.7(HO) BS-R3.1 BS-R4.1

### Notes on the sheet
- (near BS-L1) Inductor
- (near BS-H1) Power MOSFET heat sink
- L=(V_L*D*T_s)/(2*delta i)
- L=(24*0.5*1*10^-4)/(0.6)
- L=0.2mH
- Inductance calcs
- assume 1% ripple, D = 0.5, double capacitance after calculating
- C=(i_c*D*T_s)/(2*delta v)
- Capacitor Calcs
- pin 2 is drain
- pin 3 is source
- Doubling calculated capacitance, so C = 868 uF
- C = (4.17*0.5*1/10000)/(0.48) = 434 uF
- i_c = Power/Voltage = 200W/48V = 4.17A
- 2 * delta v = 0.01 * 48 = 0.48 V
- 80% electrolytic: ~695 uF
- Chose a switching freq of 10kHz
- Assume D=0.5, T_s = 1/f_s=1/10,000kHz
- V_L=V_g - (V_RL + V_Ron)=24 - (a really small number)
- 2*delta i = 15/100 * i_L = 15/100 * 4 = 0.6
- (near BS-L1) Inductor Calcs
- 20% ceramic/film: ~174 uF
- 1x 470 uF, 2x 100 uF, 1x 22 uF
- 1x 27 uF, 1x 150 uF
- * Note: Assume 15% ripple desired
- (near BS-IC1) Gate Driver
- (near BS-C2) 0.1 uF
- (near BS-C1) 0.1 uF
- (near BS-Cboot) 0.1 uF boot capacitor
- all electrolytics 220uF
- Boost Stage
- Takes a 24V input and converts the voltage
- to a 48V output by using the architecture of a
- boost converter. There is a gate driver to
- and a DC link of ceramic and electrolytic
- control the MOSFET switching. There is
- a protection scheme that follows the boost stage,
- capacitors are added for smoothing.
- Operates at a 10 kHz switching freq.

### Library data of the parts
BS-C1 BS-C2 BS-Cboot = K104K10X7RF5UH5: Capacitor; Manufacturer_Name: Vishay; Datasheet Link: https://www.vishay.com/docs/45171/kseries.pdf; Height: 6.2mm; Manufacturer_Part_Number: K104K10X7RF5UH5; Mouser Part Number: 594-K104K10X7RF5UH5; Mouser Price/Stock: https://www.mouser.co.uk/ProductDetail/Vishay-BC-Components/K104K10X7RF5UH5?qs=rLgk8CAOBHbAqIwDswVbzA%3D%3D; Arrow Part Number: K104K10X7RF5UH5; Arrow Price/Stock: https://www.arrow.com/en/products/k104k10x7rf5uh5/vishay
BS-C3-BS-C5 = EEUFS2A221: Capacitor Polarised; Manufacturer_Name: Panasonic; Datasheet Link: https://industrial.panasonic.com/cdbs/www-data/pdf/RDF0000/ABA0000C1255.pdf; Height: 27mm; Manufacturer_Part_Number: EEUFS2A221
BS-C7 BS-C8 = CMP-2100-03644-1: as DM-C19 on sheet DriveModule; Package Description: 2-Pin Surface Mount Device, Body 2 x 1.25 mm; Manufacturer URL: http://www.murata.com/; Case Code (Imperial): 0805; Datasheet URL: http://psearch.en.murata.com/capacitor/product/GRM21BR71H104KA01%23.pdf; Termination: SMD/SMT; Lead Free: LeadFree; Package Quantity: 1; Mount: SurfaceMount; REACH SVHC: Unknown; Thickness: 0.053inch; Height: 1.25mm; Case/Package: 0805; Voltage Rating: 50V; Width: 0.049inch; Case Code (Metric): 2012; Material: Ceramic; Min Operating Temperature: -55degC; RoHSCompliant: true; Datasheet Version: 42675.0; Voltage Rating (DC): 50V; Tolerance: 10%; Package Reference: 0805; Depth: 1.25mm; Length: 2mm; Max Operating Temperature: 125degC; Packaging: TapeandReel; Number of Pins: 2; Radiation Hardening: No
BS-CR = P6KE91A: No Description Available; Vendor: Littelfuse Inc; Built_By: EMA_UL_Team; Manufacturer_Part_Number: P6KE91A; Copyright: Copyright (C) 2018 Accelerated Designs. All rights reserved; RefDes: RefDes; Type: DEV; Value: Value
BS-D1 BS-D2 = CMP-07163-000046-1: DIODE GEN PURP 100V 200MA DO35; Forward Voltage: 1V; Max Power Dissipation: 500mW; Max Reverse Current: 5uA; Forward Current: 300mA; Current: 4A; Reverse Recovery Time: 4ns; Element Configuration: Single; Outside Diameter: 1.85mm; Capacitance: 4pF; Polarity: Standard; Max Forward Surge Current (Ifsm): 1A; Reverse Voltage: 100V; Output Current: 200mA; Average Rectified Current: 200mA; Diameter: 1.91mm; Max Repetitive Reverse Voltage (Vrrm): 100V; Current Rating: 200mA; Case/Package: DO-35; Lead Free: Lead Free; Number of Pins: 2; Recovery Time: 4ns; Packaging: Bulk; Contact Plating: Tin; Voltage: 100V; Mount: Through Hole; Max Surge Current: 4A; Package Quantity: 2000; Width: 1.91mm; Max Reverse Voltage (DC): 100V; Length: 4.56mm; Radiation Hardening: No; Power Dissipation: 500mW; Voltage Rating (DC): 100V; Peak Non-Repetitive Surge Current: 4A; REACH SVHC: No SVHC; Height: 4.56mm; Max Operating Temperature: 175°C; Series: -; Weight: 0.01lb; Min Operating Temperature: -65°C
BS-Dboot = SB3H100-E3_54: Schottky Diode; Manufacturer_Name: Vishay; Manufacturer_Part_Number: SB3H100-E3/54; Datasheet Link: http://www.vishay.com/docs/88720/sb3h90.pdf; Mouser Part Number: 625-SB3H100-E3; Mouser Price/Stock: https://www.mouser.com/Search/Refine.aspx?Keyword=625-SB3H100-E3
BS-H1 = WV-DT2-101E: Power MOSFET heat sink; Manufacturer_Name: Ohmite; Datasheet Link: https://componentsearchengine.com/Datasheets/1/WV-DT2-101E.pdf; Height: 32.3mm; Manufacturer_Part_Number: WV-DT2-101E; Mouser Part Number: 588-WV-DT2-101E; Mouser Price/Stock: https://www.mouser.com/Search/Refine.aspx?Keyword=588-WV-DT2-101E
BS-IC1 = IRS2184SPBF: Integrated Circuit; Manufacturer_Name: Infineon; Datasheet Link: https://www.infineon.com/dgdl/irs2184.pdf?fileId=5546d462533600a401535676d8da27db; Height: 1.75mm; Manufacturer_Part_Number: IRS2184SPBF; Mouser Part Number: 942-IRS2184SPBF; Mouser Price/Stock: https://www.mouser.co.uk/ProductDetail/Infineon-IR/IRS2184SPBF?qs=dQmlx5f5cRJ1KO8jS8%252BNRA%3D%3D; Arrow Part Number: IRS2184SPBF; Arrow Price/Stock: https://www.arrow.com/en/products/irs2184spbf/infineon-technologies-ag
BS-L1 = B66366B1018T001: Undefined or Miscellaneous; Manufacturer_Name: TDK; Datasheet Link: http://uk.rs-online.com/web/p/products/1620179; Height: 38.4mm; Manufacturer_Part_Number: B66366B1018T001; Mouser Part Number: N/A; Mouser Price/Stock: https://www.mouser.co.uk/ProductDetail/EPCOS-TDK/B66366B1018T001?qs=w5o0Loj0u7MIqxMJwOyApA%3D%3D; Arrow Part Number: B66366B1018T001; Arrow Price/Stock: http://www.arrow.com/en/products/b66366b1018t001/epcos-tdk
BS-MOS1 BS-MOS2 = IRFB4615PBF: MOSFET (N-Channel); Manufacturer_Name: Infineon; Datasheet Link: https://static6.arrow.com/aropdfconversion/fc085eb00e813bec65c58b34c53aeea1d8b02a1f/irfb4615pbf.pdf; Height: 4.83mm; Manufacturer_Part_Number: IRFB4615PBF; Mouser Part Number: 942-IRFB4615PBF; Mouser Price/Stock: https://www.mouser.co.uk/ProductDetail/Infineon-Technologies/IRFB4615PBF?qs=9%252BKlkBgLFf20BbweusQYXA%3D%3D; Arrow Part Number: IRFB4615PBF; Arrow Price/Stock: https://www.arrow.com/en/products/irfb4615pbf/infineon-technologies-ag
BS-R1 BS-R3 = CMP-2001-04157-1: Manufacturer: Vishay Dale; Part Number: CRCW08058R20JNEA
BS-R2 BS-R4 = CMP-2001-04915-1: Manufacturer: Vishay Dale; Part Number: CRCW080510R0FKEA
BS-R7 BS-R8 BS-Rboot = CMP-2001-00478-1: Manufacturer: Panasonic; Part Number: ERJ-P06J103V
BS-RV = V68ZS10P: Varistor; Manufacturer_Name: LITTELFUSE; Datasheet Link: http://www.littelfuse.com/~/media/electronics/datasheets/varistors/littelfuse_varistor_za_datasheet.pdf.pdf; Height: 20mm; Manufacturer_Part_Number: V68ZS10P; Mouser Part Number: 576-V68ZS10P; Mouser Price/Stock: https://www.mouser.co.uk/ProductDetail/Littelfuse/V68ZS10P?qs=1%2FWRN91BpNvIRlTsONWDiQ%3D%3D

## Sheet Sensing.SchDoc
size A
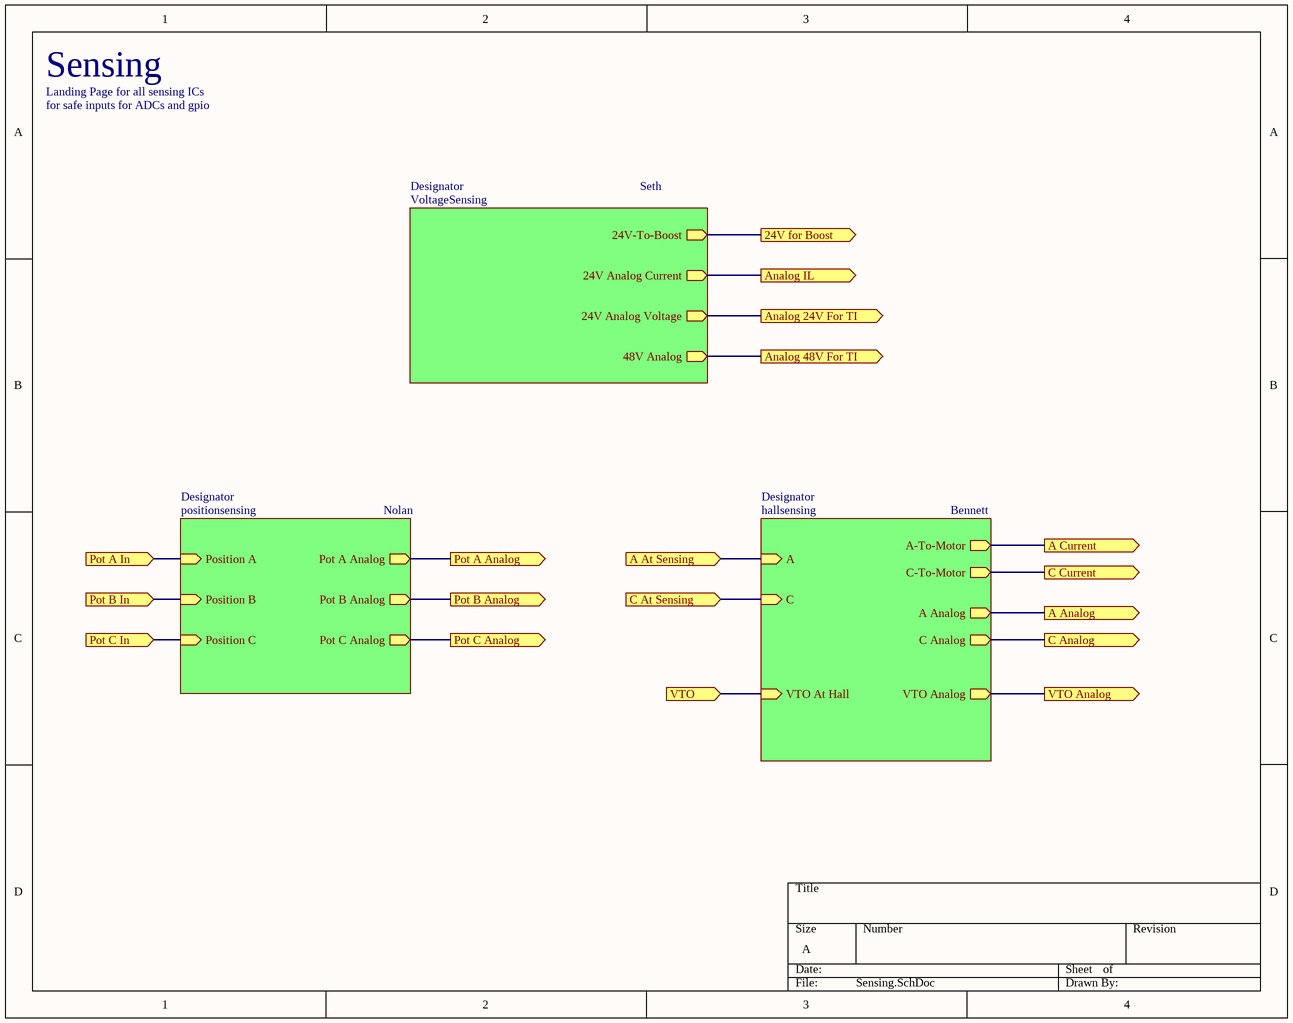
[diagram p5: Sensing.SchDoc]

### Sub-sheets
Designator = VoltageSensing: 24V Analog Current (out), 24V Analog Voltage (out), 24V-To-Boost (out), 48V Analog (out)
Designator = hallsensing: A (in), C (in), A Analog (out), C Analog (out), A-To-Motor (out), C-To-Motor (out), VTO At Hall (in), VTO Analog (out)
Designator = positionsensing: Position A (in), Position B (in), Position C (in), Pot A Analog (out), Pot B Analog (out), Pot C Analog (out)

### Ports
24V for Boost (out), A Analog (out), A At Sensing (in), A Current (out), Analog 24V For TI (out), Analog 48V For TI (out), Analog IL (out), C Analog (out), C At Sensing (in), C Current (out), Pot A Analog (out), Pot A In (in), Pot B Analog (out), Pot B In (in), Pot C Analog (out), Pot C In (in), VTO (in), VTO Analog (out)

### Nets
24V-To-Boost: port 24V for Boost, sheet Designator/24V-To-Boost
A-To-Hall: port A At Sensing, sheet Designator/A
A-To-Motor: port A Current, sheet Designator/A-To-Motor
Analog 24V- To-TI: port Analog 24V For TI, sheet Designator/24V Analog Voltage
Analog 48V- To-TI: port Analog 48V For TI, sheet Designator/48V Analog
Analog A- To-TI: port A Analog, sheet Designator/A Analog
Analog C- To-TI: port C Analog, sheet Designator/C Analog
Analog IL- To-TI: port Analog IL, sheet Designator/24V Analog Current
C-To-Hall: port C At Sensing, sheet Designator/C
C-To-Motor: port C Current, sheet Designator/C-To-Motor
hallInA: port Pot A In, sheet Designator/Position A
hallInB: port Pot B In, sheet Designator/Position B
hallInC: port Pot C In, sheet Designator/Position C
Pot A- To-TI: port Pot A Analog, sheet Designator/Pot A Analog
Pot B- To-TI: port Pot B Analog, sheet Designator/Pot B Analog
Pot C- To-TI: port Pot C Analog, sheet Designator/Pot C Analog
VTO-To-Sensing: port VTO, sheet Designator/VTO At Hall
VTO-To-TI: port VTO Analog, sheet Designator/VTO Analog

### Notes on the sheet
- Sensing
- Landing Page for all sensing ICs
- for safe inputs for ADCs and gpio
- Seth
- Nolan
- Bennett

## Sheet VoltageSensing.SchDoc
size A
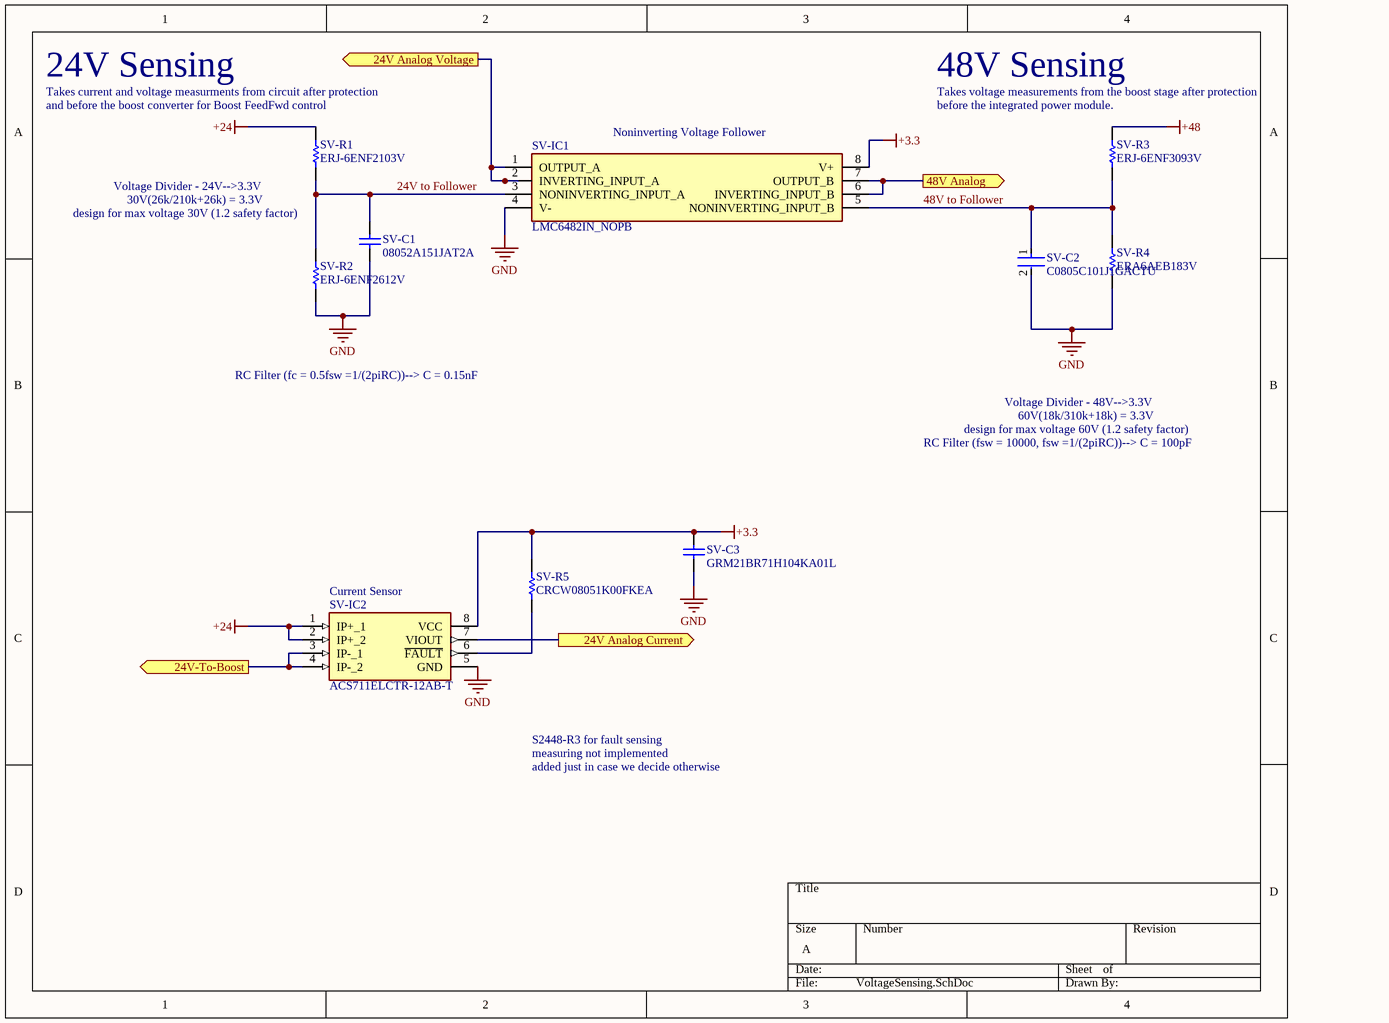
[diagram p6: VoltageSensing.SchDoc]

### Parts
SV-C1  08052A151JAT2A  [CAPC2013X140X50ML20T25]
SV-C2  C0805C101J1GACTU  [FP-C0805C-DN-MFG]
SV-C3  GRM21BR71H104KA01L  [CAPC2013X135X45ML10T25]
SV-IC1  LMC6482IN_NOPB  [DIP794W53P254L959H508Q8N]
SV-IC2  ACS711ELCTR-12AB-T  [SOIC127P600X175-8N]
SV-R1  ERJ-6ENF2103V  [RESC2013X70X40NL20T20]
SV-R2  ERJ-6ENF2612V  [RESC2013X70X40NL20T20]
SV-R3  ERJ-6ENF3093V  [RESC2013X70X40NL20T20]
SV-R4  ERA6AEB183V  [RESC2013X60X40LL20T25]
SV-R5  CRCW08051K00FKEA  [RESC2013X50X30NL20T20]

### Ports
24V Analog Current (out), 24V Analog Voltage (out), 24V-To-Boost (out), 48V Analog (out)

### Nets
+3.3: SV-C3.2 SV-IC1.8(V+) SV-IC2.8(VCC) SV-R5.2
+24: SV-IC2.1(IP+_1) SV-IC2.2(IP+_2) SV-R1.2  [project net 24V After Fuse]
+48: SV-R3.2
GND: SV-C1.1 SV-C2.2 SV-C3.1 SV-IC1.4(V-) SV-IC2.5(GND) SV-R2.1 SV-R4.1
24V to Follower: SV-C1.2 SV-IC1.3(NONINVERTING_INPUT_A) SV-R1.1 SV-R2.2
24V-To-Boost: SV-IC2.3(IP-_1) SV-IC2.4(IP-_2) ; port 24V-To-Boost
48V to Follower: SV-C2.1 SV-IC1.5(NONINVERTING_INPUT_B) SV-R3.1 SV-R4.2
Analog 24V- To-TI: SV-IC1.1(OUTPUT_A) SV-IC1.2(INVERTING_INPUT_A) ; port 24V Analog Voltage
Analog 48V- To-TI: SV-IC1.6(INVERTING_INPUT_B) SV-IC1.7(OUTPUT_B) ; port 48V Analog
Analog IL- To-TI: SV-IC2.7(VIOUT) ; port 24V Analog Current
NetSV-IC2_6: SV-IC2.6(~{FAULT}) SV-R5.1

### Notes on the sheet
- 24V Sensing
- (near SV-R1) Takes current and voltage measurments from circuit after protection
- 48V Sensing
- (near SV-R3) Takes voltage measurements from the boost stage after protection
- (near SV-R1) and before the boost converter for Boost FeedFwd control
- (near SV-IC1) Noninverting Voltage Follower
- (near SV-R3) before the integrated power module.
- (near SV-C1) design for max voltage 30V (1.2 safety factor)
- (near SV-R1) Voltage Divider - 24V-->3.3V
- 30V(26k/210k+26k) = 3.3V
- RC Filter (fc = 0.5fsw =1/(2piRC))--> C = 0.15nF
- design for max voltage 60V (1.2 safety factor)
- Voltage Divider - 48V-->3.3V
- 60V(18k/310k+18k) = 3.3V
- RC Filter (fsw = 10000, fsw =1/(2piRC))--> C = 100pF
- (near SV-IC2) Current Sensor
- S2448-R3 for fault sensing
- measuring not implemented
- added just in case we decide otherwise

### Library data of the parts
SV-C1 = CMP-2007-04584-1: Manufacturer: AVX Interconnect / Elco; Part Number: 08052A151JAT2A
SV-C2 = CMP-03020-014281-1: CAP CER 100PF 100V C0G/NP0 0805; Manufacturer: KEMET; Temperature Coefficient: 30ppm/°C; Temperature Characteristic: C0G; Tolerance: 0.05; RoHS: TRUE; ComponentLink2URL: https://content.kemet.com/datasheets/KEM_C1003_C0G_SMD.pdf; Voltage Rating: 100 V; Height: 0.88mm; Capacitance: 100 pF; Device Class L3: Ceramic Capacitors; Temperature: -55°C to +125°C; Manufacturer Part Number: C0805C101J1GACTU; Digikey Description: CAP CER 100PF 100V C0G/NP0 0805; Device Class L1: Passive Components; Lead Free: Yes; Package: C0805C-DN; Octopart: https://octopart.com/c0805c101j1gactu-kemet-123666; Automotive: No; Category: Cap; Temperature Range High: +125°C; Mouser Description: Multilayer Ceramic Capacitors MLCC - SMD/SMT 100volts 100pF C0G 5%; Temperature Range Low: -55°C; ComponentLink2Description: Datasheet; Ipc Land Pattern Name: CAPC200125X78; Material: Ceramic; Device Class L2: Capacitors; Value: 100 pF
SV-C3 = CMP-2100-03644-1: as DM-C19 on sheet DriveModule; Package Description: 2-Pin Surface Mount Device, Body 2 x 1.25 mm; Manufacturer URL: http://www.murata.com/; Case Code (Imperial): 0805; Datasheet URL: http://psearch.en.murata.com/capacitor/product/GRM21BR71H104KA01%23.pdf; Termination: SMD/SMT; Lead Free: LeadFree; Package Quantity: 1; Mount: SurfaceMount; REACH SVHC: Unknown; Thickness: 0.053inch; Height: 1.25mm; Case/Package: 0805; Voltage Rating: 50V; Width: 0.049inch; Case Code (Metric): 2012; Material: Ceramic; Min Operating Temperature: -55degC; RoHSCompliant: true; Datasheet Version: 42675.0; Voltage Rating (DC): 50V; Tolerance: 10%; Package Reference: 0805; Depth: 1.25mm; Length: 2mm; Max Operating Temperature: 125degC; Packaging: TapeandReel; Number of Pins: 2; Radiation Hardening: No
SV-IC1 = LMC6482IN_NOPB: Integrated Circuit; Manufacturer_Name: Texas Instruments; Manufacturer_Part_Number: LMC6482IN/NOPB; Datasheet Link: http://www.ti.com/lit/gpn/lmc6482; Height: 5.08mm; Mouser Part Number: 926-LMC6482IN/NOPB; Mouser Price/Stock: https://www.mouser.co.uk/ProductDetail/Texas-Instruments/LMC6482IN-NOPB?qs=QbsRYf82W3EByDDrj8Vijg%3D%3D; Arrow Part Number: LMC6482IN/NOPB; Arrow Price/Stock: https://www.arrow.com/en/products/lmc6482innopb/texas-instruments
SV-IC2 = ACS711ELCTR-12AB-T: Integrated Circuit; Manufacturer_Name: Allegro Microsystems; Datasheet Link: https://www.allegromicro.com/~/media/Files/Datasheets/ACS711-Datasheet.ashx; Height: 1.75mm; Manufacturer_Part_Number: ACS711ELCTR-12AB-T; Arrow Part Number: ACS711ELCTR-12AB-T; Arrow Price/Stock: https://www.arrow.com/en/products/acs711elctr-12ab-t/allegro-microsystems
SV-R1 = CMP-2001-00038-1: Manufacturer: Panasonic; Part Number: ERJ-6ENF2103V
SV-R2 = CMP-1013-00668-2: Manufacturer: Panasonic; Part Number: ERJ-6ENF2612V
SV-R3 = CMP-2001-00119-1: Manufacturer: Panasonic; Part Number: ERJ-6ENF3093V
SV-R4 = CMP-2001-00606-1: Manufacturer: Panasonic; Part Number: ERA6AEB183V
SV-R5 = CMP-1013-00510-2: Manufacturer: Vishay Dale; Part Number: CRCW08051K00FKEA

## Sheet hallsensing.SchDoc
size A
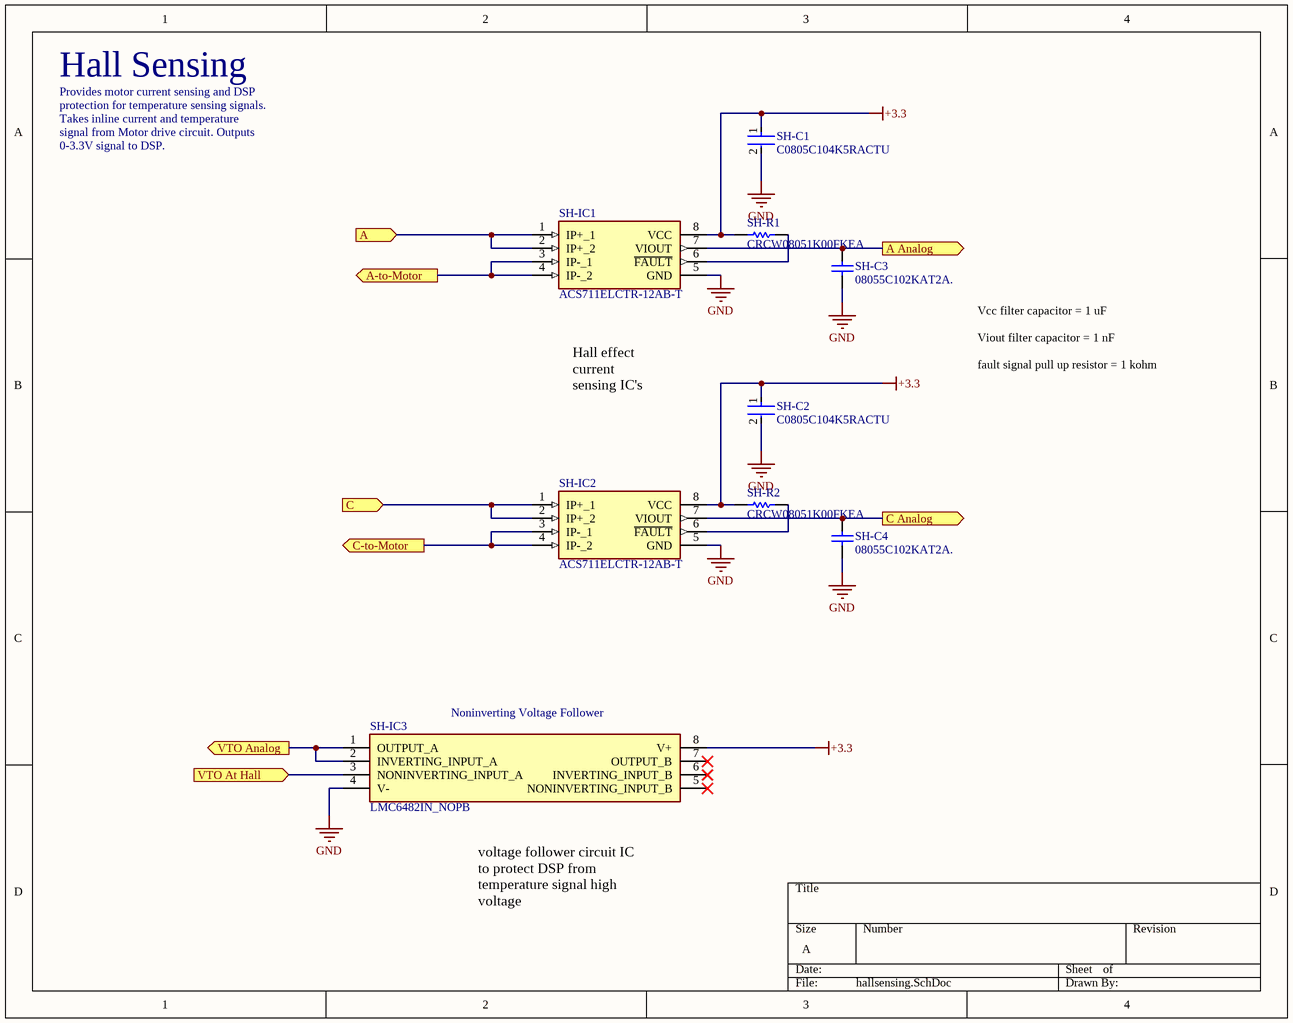
[diagram p7: hallsensing.SchDoc]

### Parts
SH-C1  C0805C104K5RACTU  [FP-C0805C-DN-MFG]
SH-C2  C0805C104K5RACTU  [FP-C0805C-DN-MFG]
SH-C3  08055C102KAT2A.  [CAPC2013X94X50ML20T25]
SH-C4  08055C102KAT2A.  [CAPC2013X94X50ML20T25]
SH-IC1  ACS711ELCTR-12AB-T  [SOIC127P600X175-8N]
SH-IC2  ACS711ELCTR-12AB-T  [SOIC127P600X175-8N]
SH-IC3  LMC6482IN_NOPB  [DIP794W53P254L959H508Q8N]
SH-R1  CRCW08051K00FKEA  [RESC2013X50X30NL20T20]
SH-R2  CRCW08051K00FKEA  [RESC2013X50X30NL20T20]

### Ports
A (in), A Analog (out), A-to-Motor (out), C (in), C Analog (out), C-to-Motor (out), VTO Analog (out), VTO At Hall (in)

### Nets
+3.3: SH-C1.1 SH-C2.1 SH-IC1.8(VCC) SH-IC2.8(VCC) SH-IC3.8(V+) SH-R1.1 SH-R2.1
GND: SH-C1.2 SH-C2.2 SH-C3.1 SH-C4.1 SH-IC1.5(GND) SH-IC2.5(GND) SH-IC3.4(V-)
A-To-Hall: SH-IC1.1(IP+_1) SH-IC1.2(IP+_2) ; port A
A-To-Motor: SH-IC1.3(IP-_1) SH-IC1.4(IP-_2) ; port A-to-Motor
Analog A- To-TI: SH-C3.2 SH-IC1.7(VIOUT) ; port A Analog
Analog C- To-TI: SH-C4.2 SH-IC2.7(VIOUT) ; port C Analog
C-To-Hall: SH-IC2.1(IP+_1) SH-IC2.2(IP+_2) ; port C
C-To-Motor: SH-IC2.3(IP-_1) SH-IC2.4(IP-_2) ; port C-to-Motor
VTO-To-Sensing: SH-IC3.3(NONINVERTING_INPUT_A) ; port VTO At Hall
VTO-To-TI: SH-IC3.1(OUTPUT_A) SH-IC3.2(INVERTING_INPUT_A) ; port VTO Analog
NetSH-IC1_6: SH-IC1.6(~{FAULT}) SH-R1.2
NetSH-IC2_6: SH-IC2.6(~{FAULT}) SH-R2.2

Not connected (* = marked no-connect by the designer): SH-IC3 5(NONINVERTING_INPUT_B)* 6(INVERTING_INPUT_B)* 7(OUTPUT_B)*

### Notes on the sheet
- Hall Sensing
- Provides motor current sensing and DSP
- protection for temperature sensing signals.
- Takes inline current and temperature
- signal from Motor drive circuit. Outputs
- 0-3.3V signal to DSP.
- Hall effect current sensing IC's
- Vcc filter capacitor = 1 uF
  Viout filter capacitor = 1 nF
  fault signal pull up resistor = 1 kohm
- (near SH-IC3) Noninverting Voltage Follower
- voltage follower circuit IC to protect DSP from temperature signal high voltage

### Library data of the parts
SH-C1 SH-C2 = CMP-2007-00279-2: CAP CER 0.1UF 50V X7R 0805; Manufacturer: KEMET; Value: 0.10 μF; Tolerance: 0.1; Temperature Coefficient: 30ppm/°C; Manufacturer Part Number: C0805C104K5RACTU; Device Class L2: Capacitors; Temperature Range Low: -55°C; Voltage Rating: 50 V; Digikey Description: CAP CER 0.1UF 50V X7R 0805; Category: Cap; ComponentLink2Description: Datasheet; Octopart: https://octopart.com/c0805c104k5ractu-kemet-143926; RoHS: TRUE; ComponentLink2URL: https://content.kemet.com/datasheets/KEM_C1003_C0G_SMD.pdf; Temperature Characteristic: X7R; Temperature: -55°C to +125°C; Height: 0.88mm; Temperature Range High: +125°C; Device Class L1: Passive Components; Automotive: No; Lead Free: Yes; Ipc Land Pattern Name: CAPC200125X78; Material: Ceramic; Device Class L3: Ceramic Capacitors; Mouser Description: Cap Ceramic 0.1uF 50V X7R 10% SMD 2.0 x 1.2 mm 125 C Paper T/R; Capacitance: 0.10 μF; Package: C0805C-DN
SH-C3 SH-C4 = CMP-1036-02979-2: Manufacturer: AVX Interconnect / Elco; Part Number: 08055C102KAT2A.
SH-IC1 SH-IC2 = ACS711ELCTR-12AB-T: 12A current sensing Integrated Circuit; Manufacturer_Name: Allegro Microsystems; Datasheet Link: https://www.allegromicro.com/~/media/Files/Datasheets/ACS711-Datasheet.ashx; Height: 1.75mm; Manufacturer_Part_Number: ACS711ELCTR-12AB-T; Arrow Part Number: ACS711ELCTR-12AB-T; Arrow Price/Stock: https://www.arrow.com/en/products/acs711elctr-12ab-t/allegro-microsystems
SH-IC3 = LMC6482IN_NOPB: OP-AMP voltage follower Integrated Circuit; Manufacturer_Name: Texas Instruments; Manufacturer_Part_Number: LMC6482IN/NOPB; Datasheet Link: http://www.ti.com/lit/gpn/lmc6482; Height: 5.08mm; Mouser Part Number: 926-LMC6482IN/NOPB; Mouser Price/Stock: https://www.mouser.co.uk/ProductDetail/Texas-Instruments/LMC6482IN-NOPB?qs=QbsRYf82W3EByDDrj8Vijg%3D%3D; Arrow Part Number: LMC6482IN/NOPB; Arrow Price/Stock: https://www.arrow.com/en/products/lmc6482innopb/texas-instruments
SH-R1 SH-R2 = CMP-1013-00510-2: Manufacturer: Vishay Dale; Part Number: CRCW08051K00FKEA

## Sheet positionsensing.SchDoc
size A
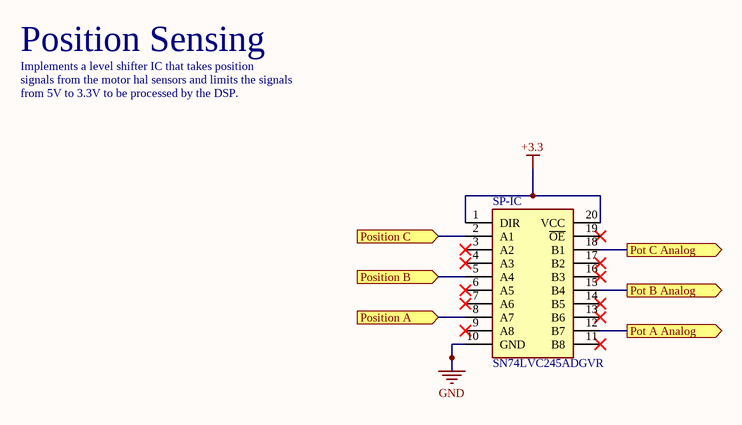
[diagram p8: positionsensing.SchDoc]

### Parts
SP-IC  SN74LVC245ADGVR  [SOP40P640X120-20N]

### Ports
Position A (in), Position B (in), Position C (in), Pot A Analog (out), Pot B Analog (out), Pot C Analog (out)

### Nets
+3.3: SP-IC.1(DIR) SP-IC.20(VCC)
GND: SP-IC.10(GND)
hallInA: SP-IC.8(A7) ; port Position A
hallInB: SP-IC.5(A4) ; port Position B
hallInC: SP-IC.2(A1) ; port Position C
Pot A- To-TI: SP-IC.12(B7) ; port Pot A Analog
Pot B- To-TI: SP-IC.15(B4) ; port Pot B Analog
Pot C- To-TI: SP-IC.18(B1) ; port Pot C Analog

Not connected (* = marked no-connect by the designer): SP-IC 3(A2)* 4(A3)* 6(A5)* 7(A6)* 9(A8)* 11(B8)* 13(B6)* 14(B5)* 16(B3)* 17(B2)* 19(~{OE})*

### Notes on the sheet
- Position Sensing
- Implements a level shifter IC that takes position
- signals from the motor hal sensors and limits the signals
- from 5V to 3.3V to be processed by the DSP.

### Library data of the parts
SP-IC = SN74LVC245ADGVR: Integrated Circuit; Manufacturer_Name: Texas Instruments; Datasheet Link: http://www.ti.com/lit/gpn/sn74lvc245a; Height: 1.2mm; Manufacturer_Part_Number: SN74LVC245ADGVR; Mouser Part Number: 595-SN74LVC245ADGVR; Mouser Price/Stock: https://www.mouser.co.uk/ProductDetail/Texas-Instruments/SN74LVC245ADGVR?qs=OorDGPQ79ErH2VKzCctyvg%3D%3D; Arrow Part Number: SN74LVC245ADGVR; Arrow Price/Stock: https://www.arrow.com/en/products/sn74lvc245adgvr/texas-instruments

## Nets that join several sheets
24V After Fuse: PowerSupply (7 pins), VoltageSensing (SV-IC2.1 SV-IC2.2 SV-R1.2)
+3.3: ee453_pcb_N-B-S (J1.1), PowerSupply (PS-PS1.6), TILaunchpad (TI-U1.1 TI-U1.41), VoltageSensing (SV-C3.2 SV-IC1.8 SV-IC2.8 SV-R5.2), hallsensing (7 pins), positionsensing (SP-IC.1 SP-IC.20)
+5: ee453_pcb_N-B-S (J4.1 MAIN-R1.2 MAIN-R2.2 MAIN-R3.2), PowerSupply (PS-R1.1 PS-R2.2)
+12: PowerSupply (PS-PS2.6 PS-R1.2), BoostStage (BS-C1.2 BS-IC1.5 BS-Rboot.2)
+15: PowerSupply (PS-PS3.6), DriveModule (8 pins)
+48: ee453_pcb_N-B-S (J2.1), DriveModule (DM-C19.1 DM-U1.27), BoostStage (9 pins), VoltageSensing (SV-R3.2)
GND: ee453_pcb_N-B-S (J0.2 J1.3 J2.2 J4.5), PowerSupply (10 pins), TILaunchpad (TI-U1.20 TI-U1.22 TI-U1.60 TI-U1.62), DriveModule (16 pins), BoostStage (16 pins), VoltageSensing (7 pins), hallsensing (7 pins), positionsensing (SP-IC.10)
24V-To-Boost: BoostStage (9 pins), VoltageSensing (SV-IC2.3 SV-IC2.4)
A-To-Hall: DriveModule (DM-U1.24), hallsensing (SH-IC1.1 SH-IC1.2)
A-To-Motor: ee453_pcb_N-B-S (J3.1 J3.2), hallsensing (SH-IC1.3 SH-IC1.4)
Analog 24V- To-TI: TILaunchpad (TI-U1.67), VoltageSensing (SV-IC1.1 SV-IC1.2)
Analog 48V- To-TI: TILaunchpad (TI-U1.66), VoltageSensing (SV-IC1.6 SV-IC1.7)
Analog A- To-TI: TILaunchpad (TI-U1.23), hallsensing (SH-C3.2 SH-IC1.7)
Analog C- To-TI: TILaunchpad (TI-U1.24), hallsensing (SH-C4.2 SH-IC2.7)
Analog IL- To-TI: TILaunchpad (TI-U1.48), VoltageSensing (SV-IC2.7)
B-To-Motor: ee453_pcb_N-B-S (J3.3 J3.4), DriveModule (DM-U1.25)
C-To-Hall: DriveModule (DM-U1.26), hallsensing (SH-IC2.1 SH-IC2.2)
C-To-Motor: ee453_pcb_N-B-S (J3.5 J3.6), hallsensing (SH-IC2.3 SH-IC2.4)
hallInA: ee453_pcb_N-B-S (J4.2 MAIN-R1.1), positionsensing (SP-IC.8)
hallInB: ee453_pcb_N-B-S (J4.3 MAIN-R2.1), positionsensing (SP-IC.5)
hallInC: ee453_pcb_N-B-S (J4.4 MAIN-R3.1), positionsensing (SP-IC.2)
NetJ0_1: ee453_pcb_N-B-S (J0.1), PowerSupply (PS-FH1.1)
Pot A- To-TI: TILaunchpad (TI-U1.73), positionsensing (SP-IC.12)
Pot B- To-TI: TILaunchpad (TI-U1.72), positionsensing (SP-IC.15)
Pot C- To-TI: TILaunchpad (TI-U1.71), positionsensing (SP-IC.18)
PWM-A-Bot: TILaunchpad (TI-U1.39), DriveModule (DM-R1.1)
PWM-A-Top: TILaunchpad (TI-U1.40), DriveModule (DM-R6.1)
PWM-B-Bot: TILaunchpad (TI-U1.35), DriveModule (DM-R2.1)
PWM-B-Top: TILaunchpad (TI-U1.36), DriveModule (DM-R7.1)
PWM-C-Bot: TILaunchpad (TI-U1.31), DriveModule (DM-R3.1)
PWM-C-Top: TILaunchpad (TI-U1.32), DriveModule (DM-R8.1)
PWM-To-Boost: TILaunchpad (TI-U1.80), BoostStage (BS-IC1.1)
SD: TILaunchpad (TI-U1.79), BoostStage (BS-IC1.2)
Throttle: ee453_pcb_N-B-S (J1.2), TILaunchpad (TI-U1.63)
VFO-To-TI: TILaunchpad (TI-U1.30), DriveModule (DM-C4.2 DM-R5.1)
VTO-To-Sensing: DriveModule (DM-C6.2 DM-U1.7), hallsensing (SH-IC3.3)
VTO-To-TI: TILaunchpad (TI-U1.29), hallsensing (SH-IC3.1 SH-IC3.2)